# EAGLE design Cypher (EAGLE 9.0.1)
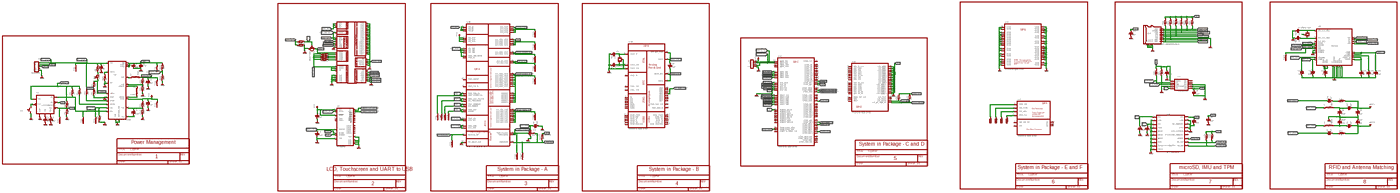
[diagram p0: schematic, sheet 1, overview]
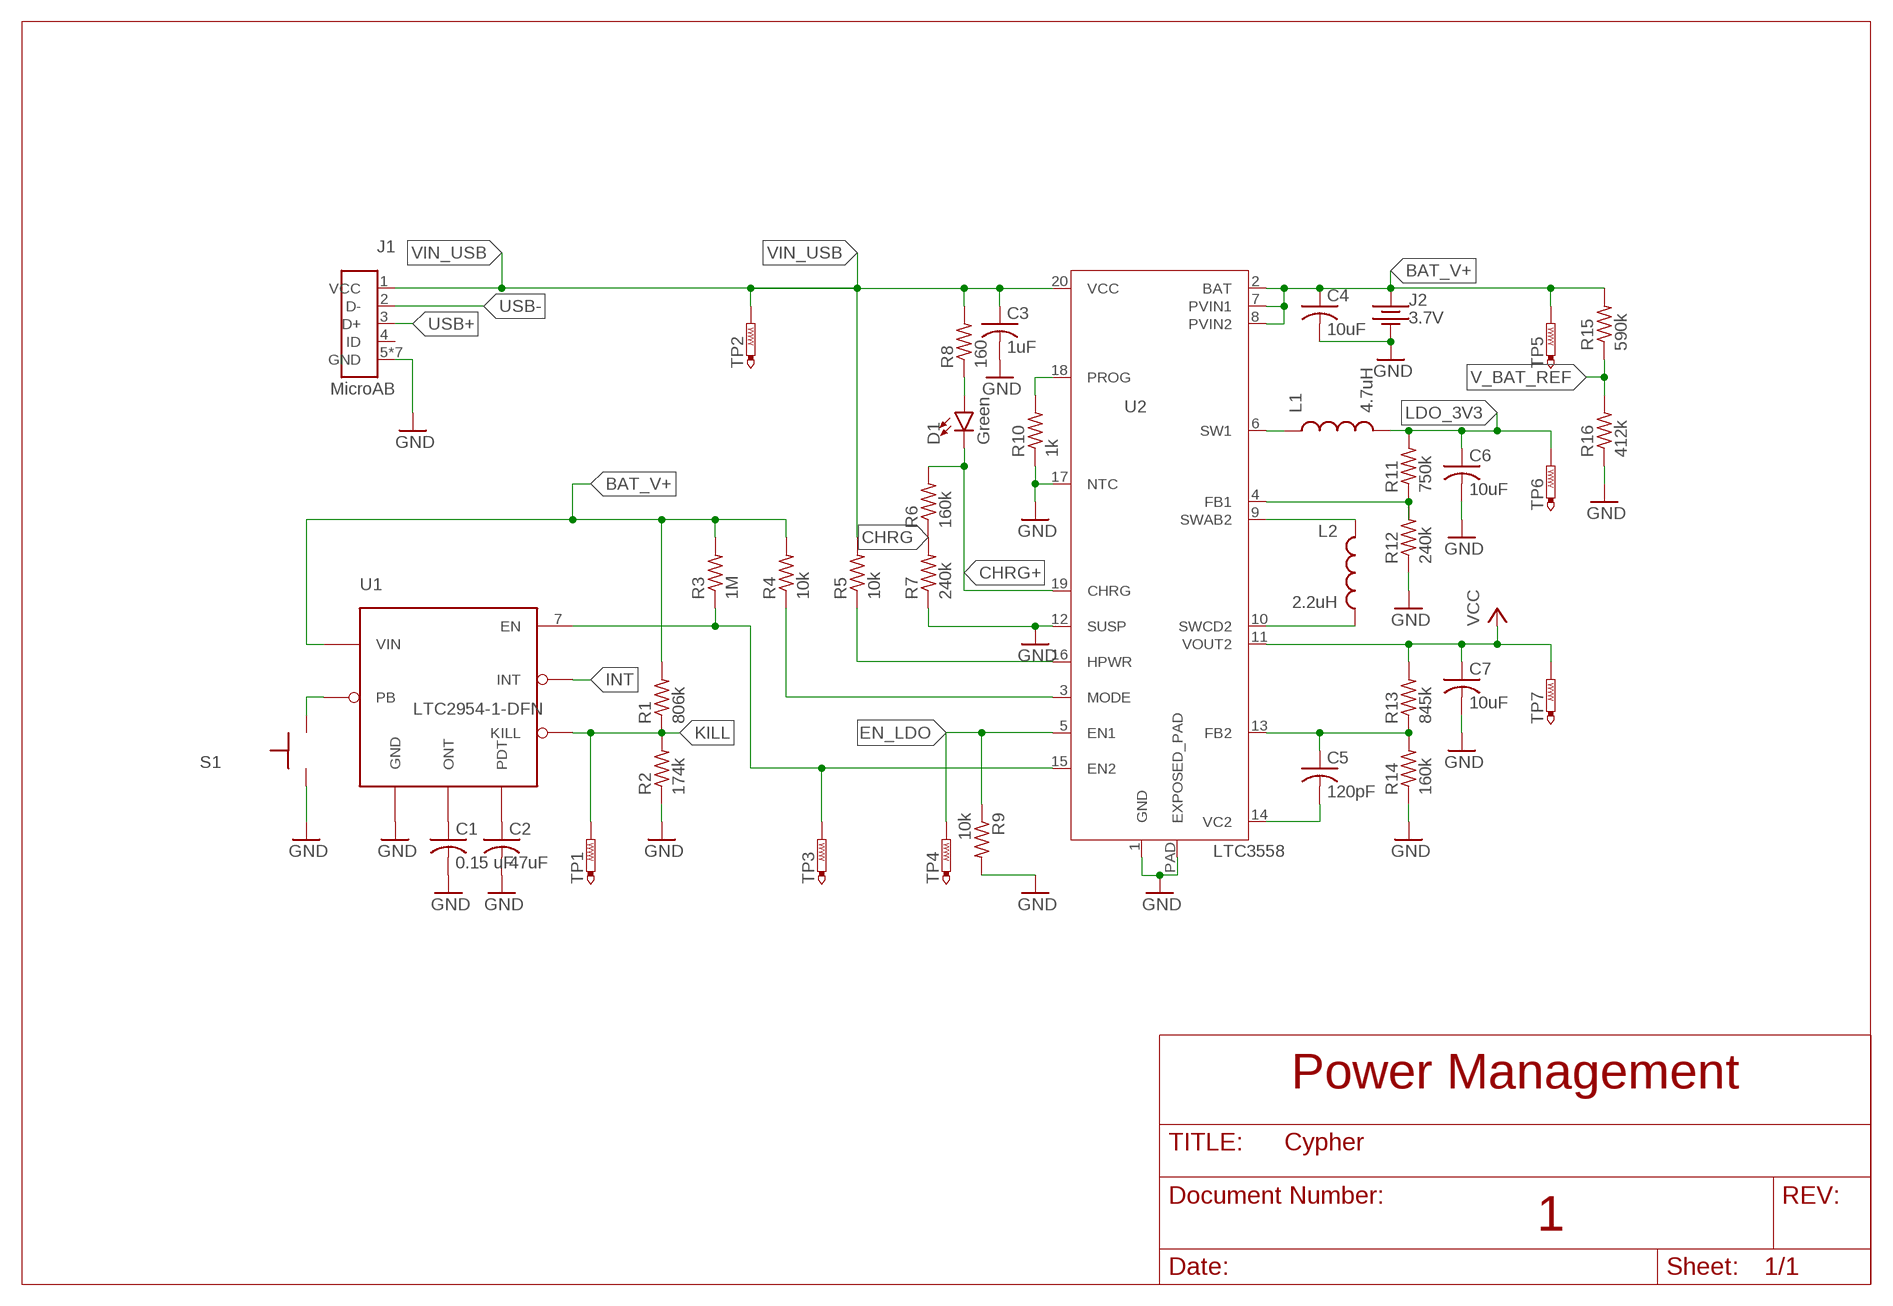
[diagram p1: schematic, sheet 1, part 1 of 6]
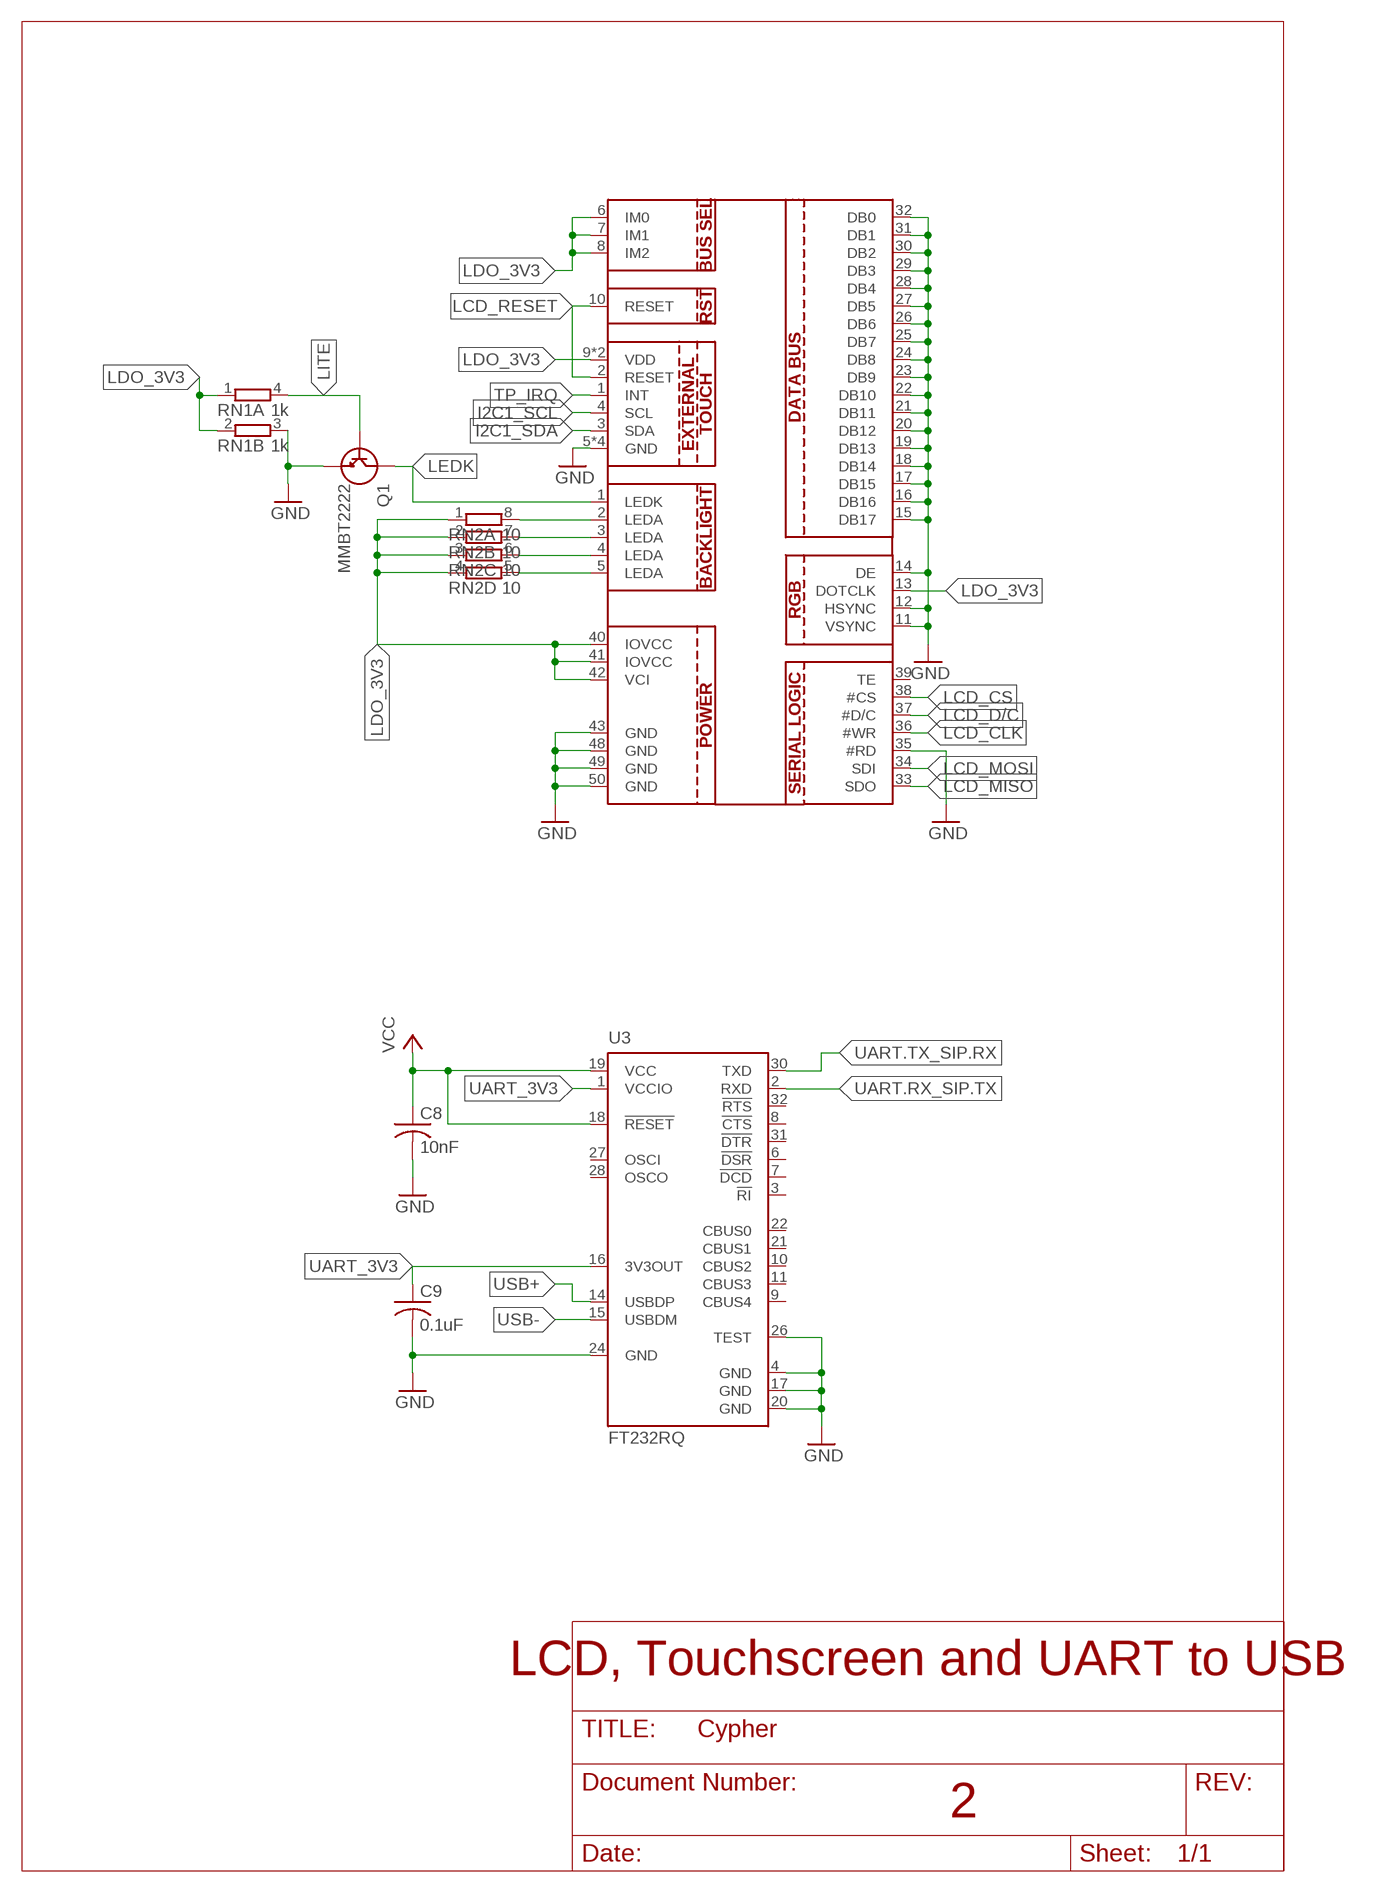
[diagram p2: schematic, sheet 1, part 2 of 6]
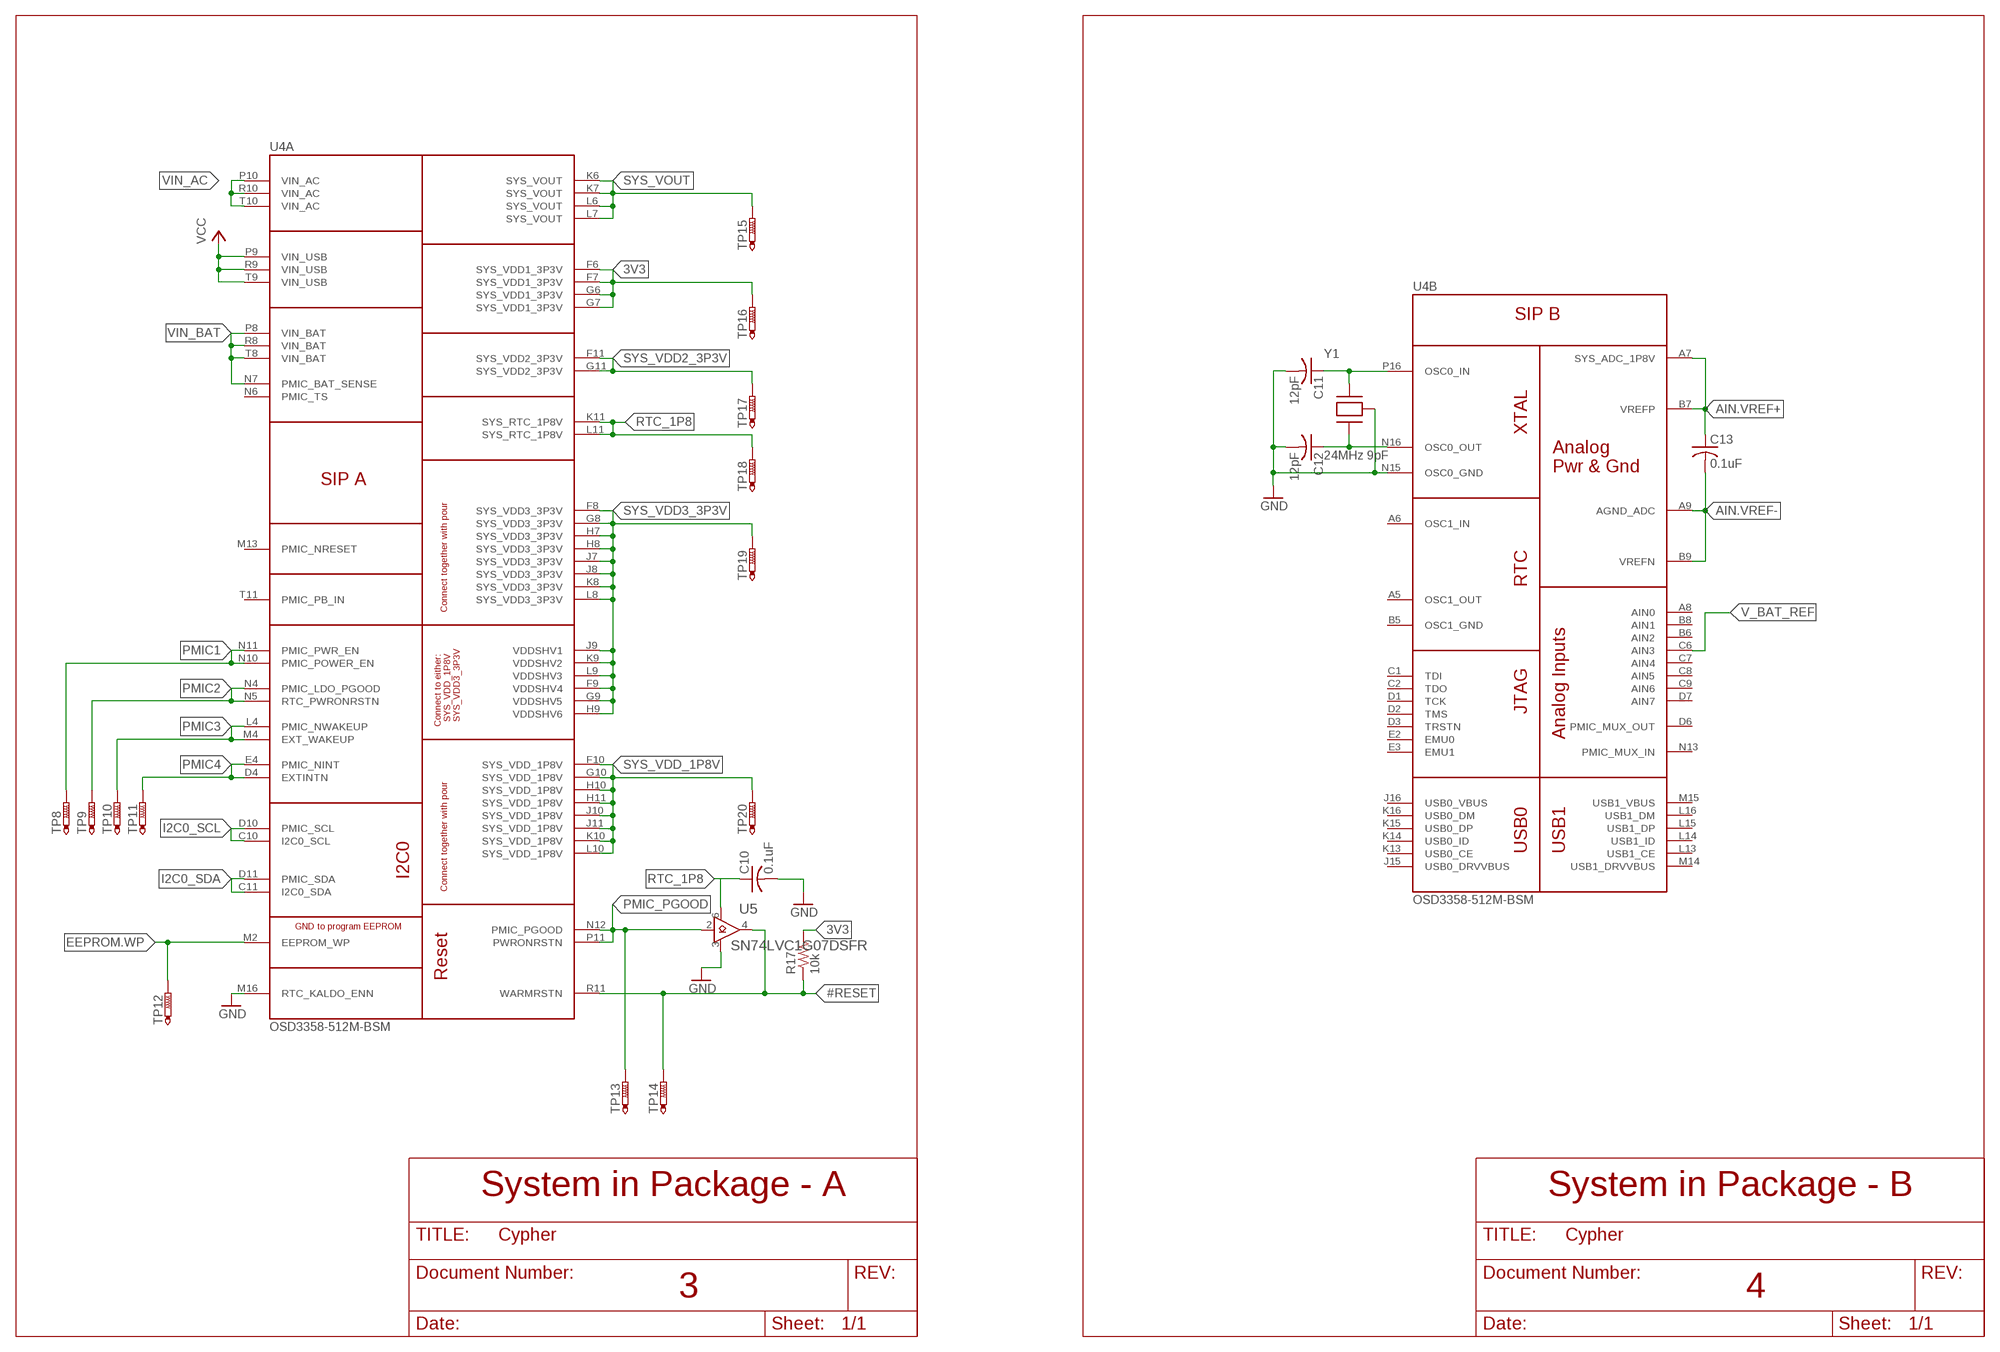
[diagram p3: schematic, sheet 1, part 3 of 6]
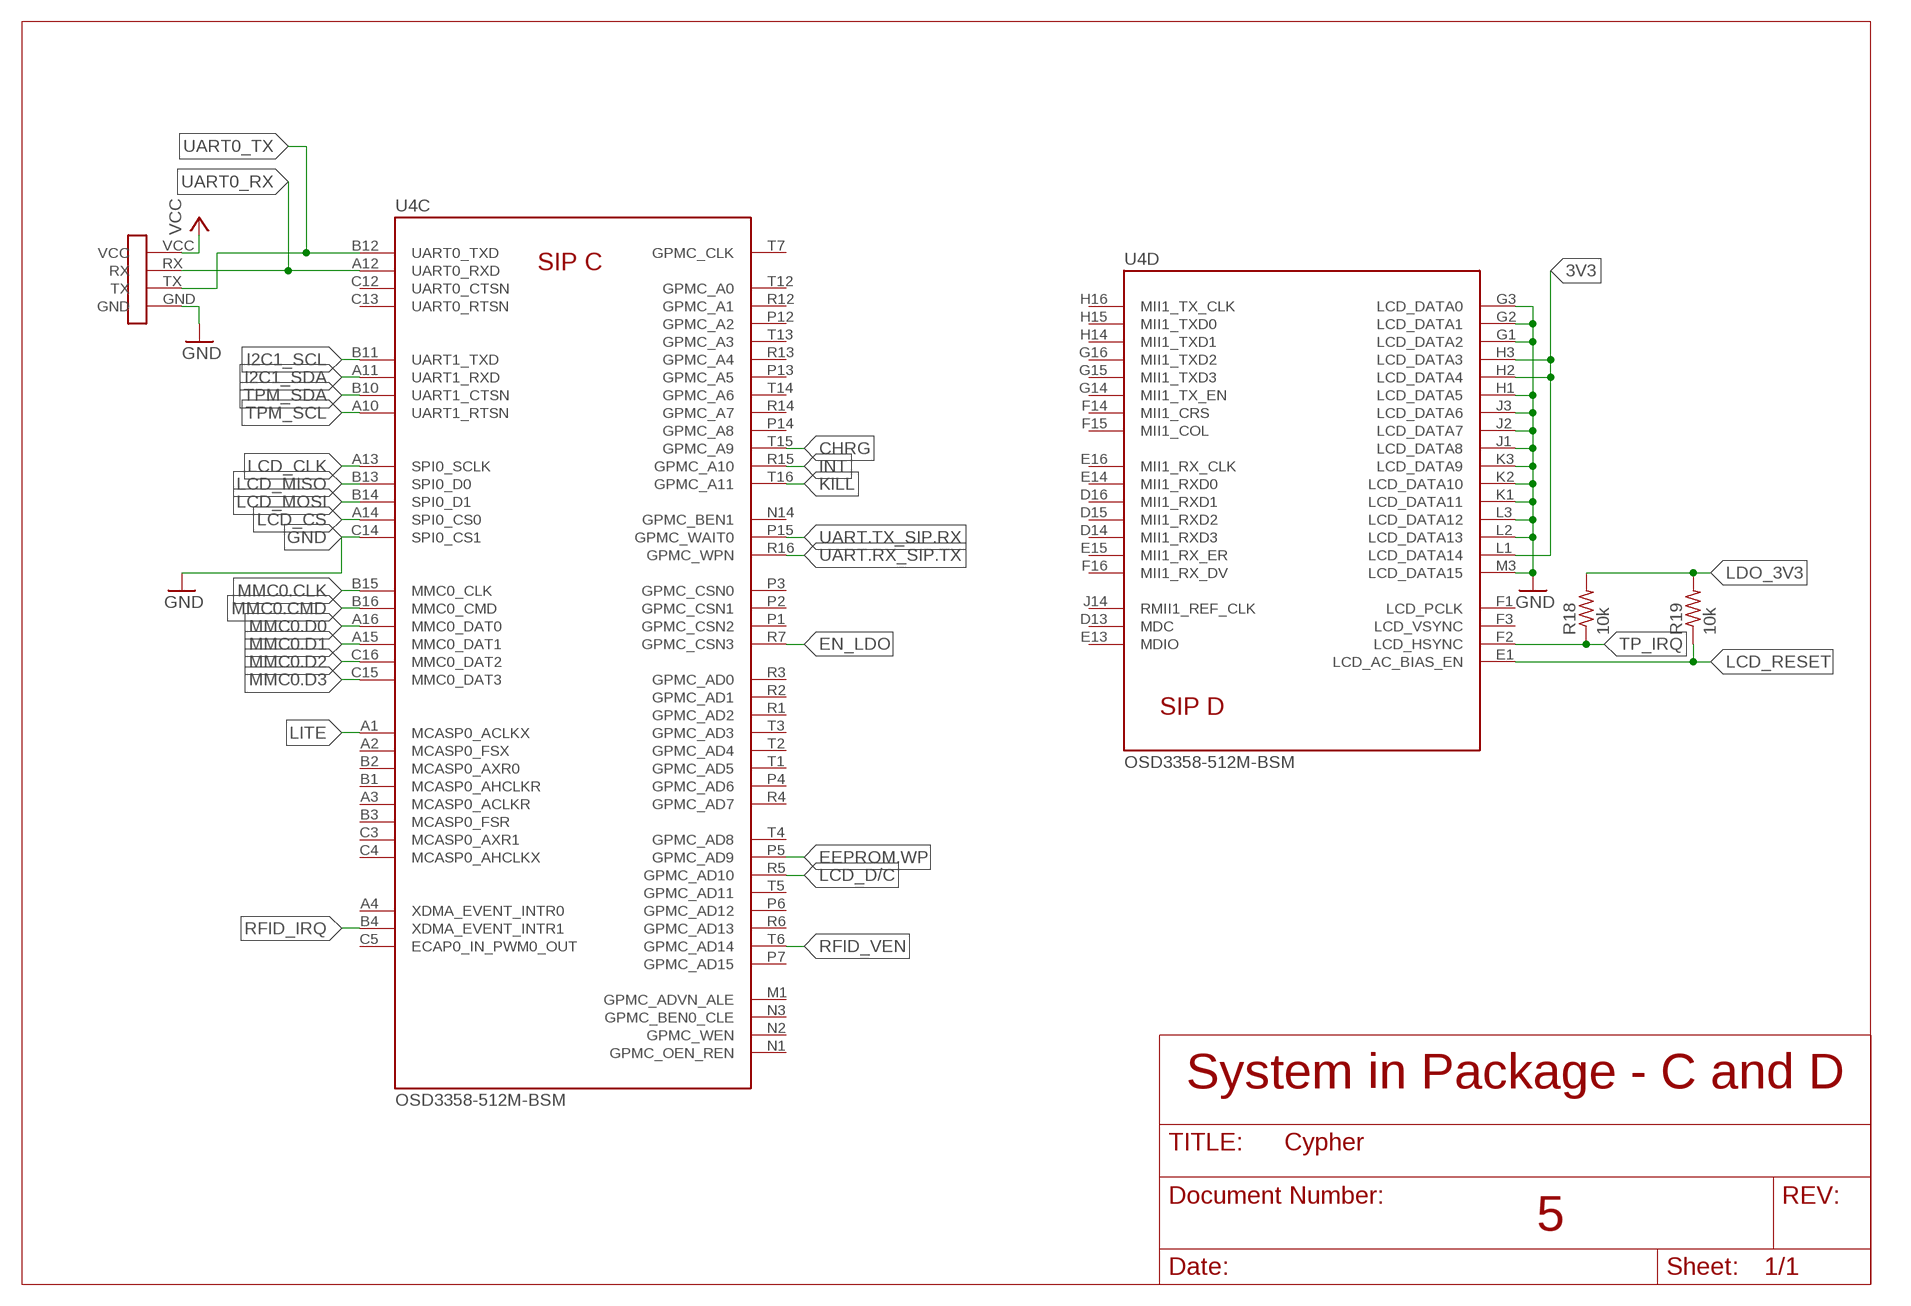
[diagram p4: schematic, sheet 1, part 4 of 6]
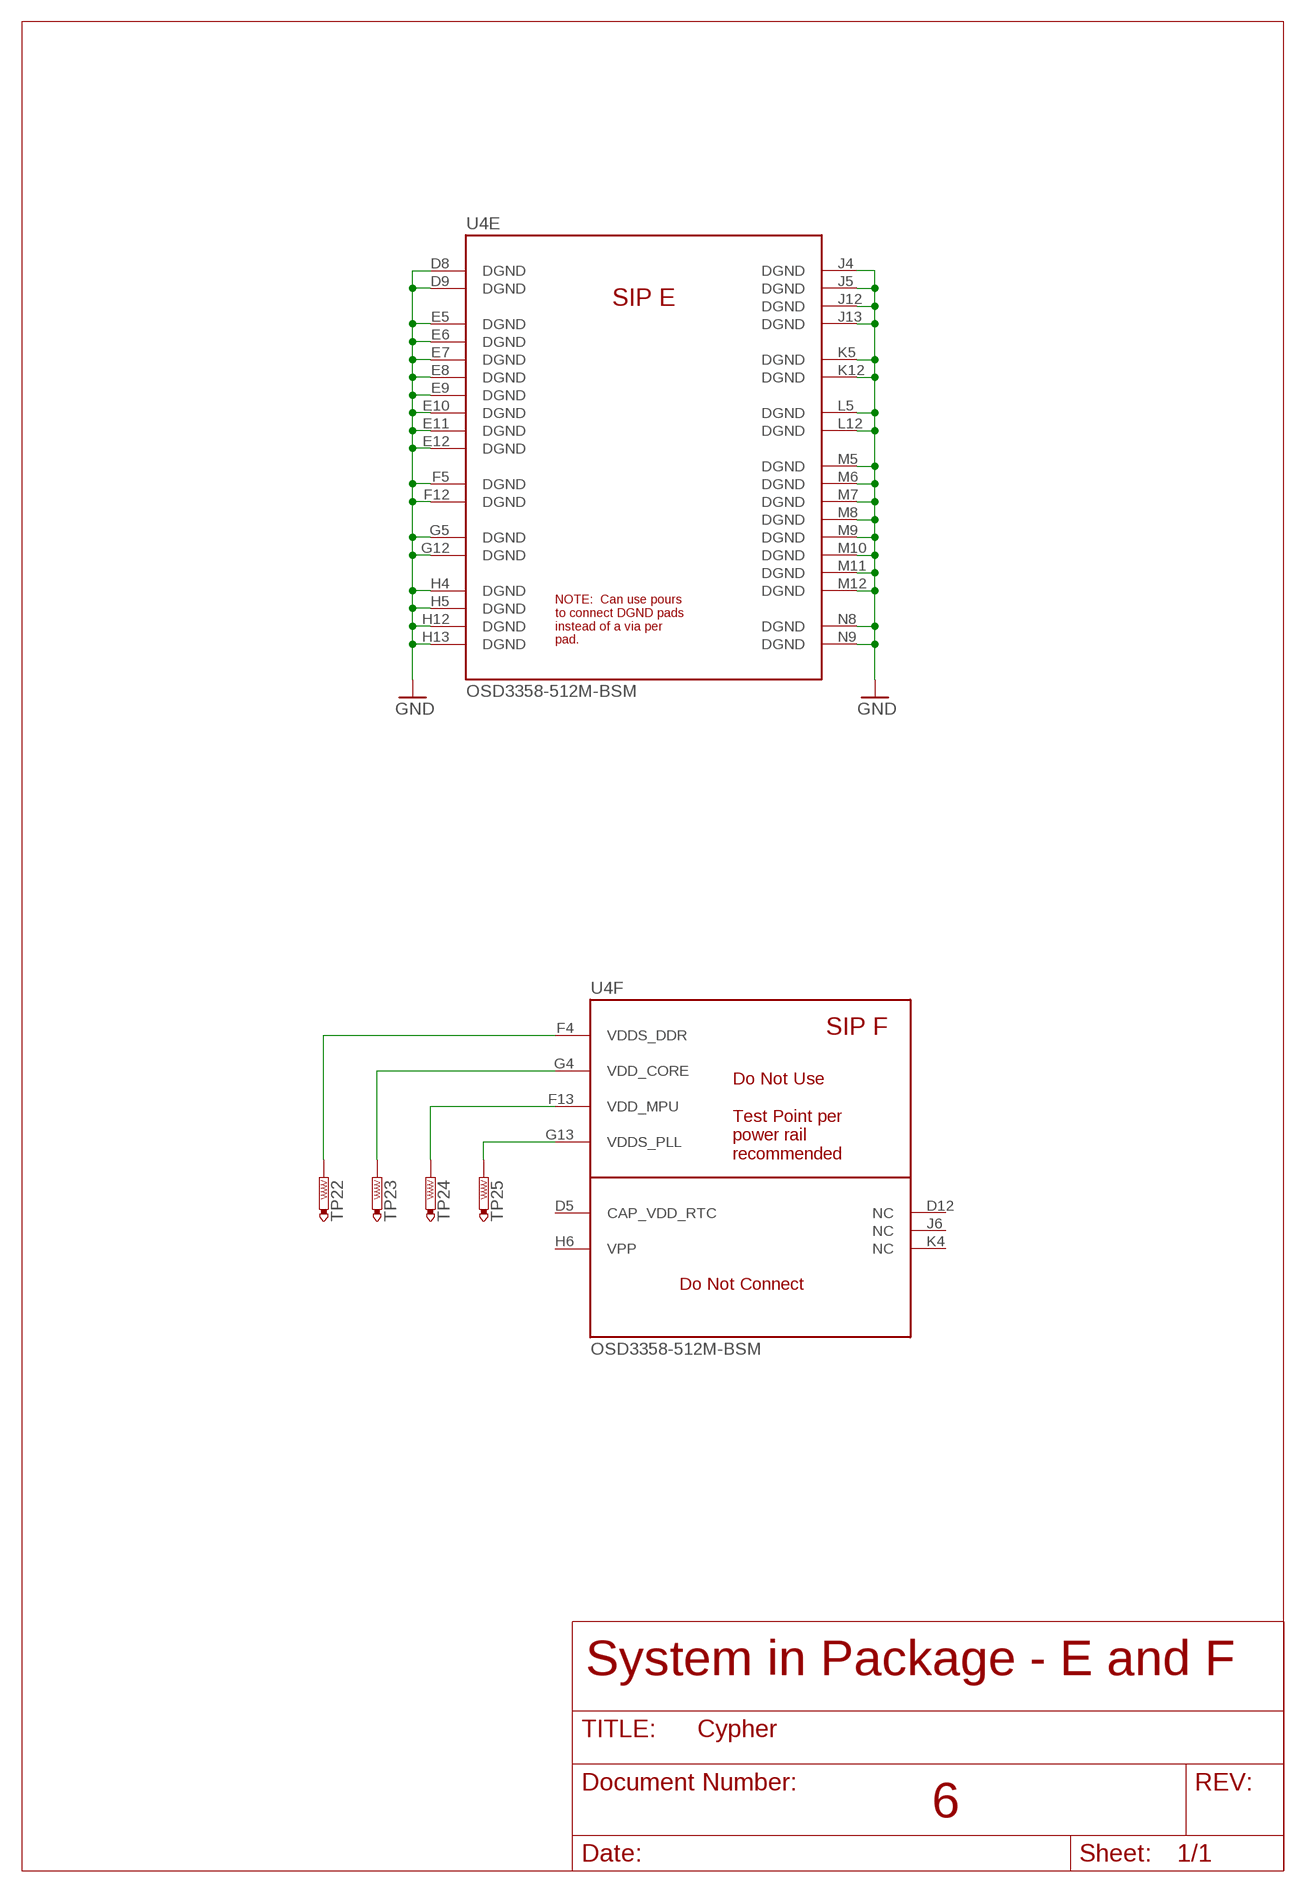
[diagram p5: schematic, sheet 1, part 5 of 6]
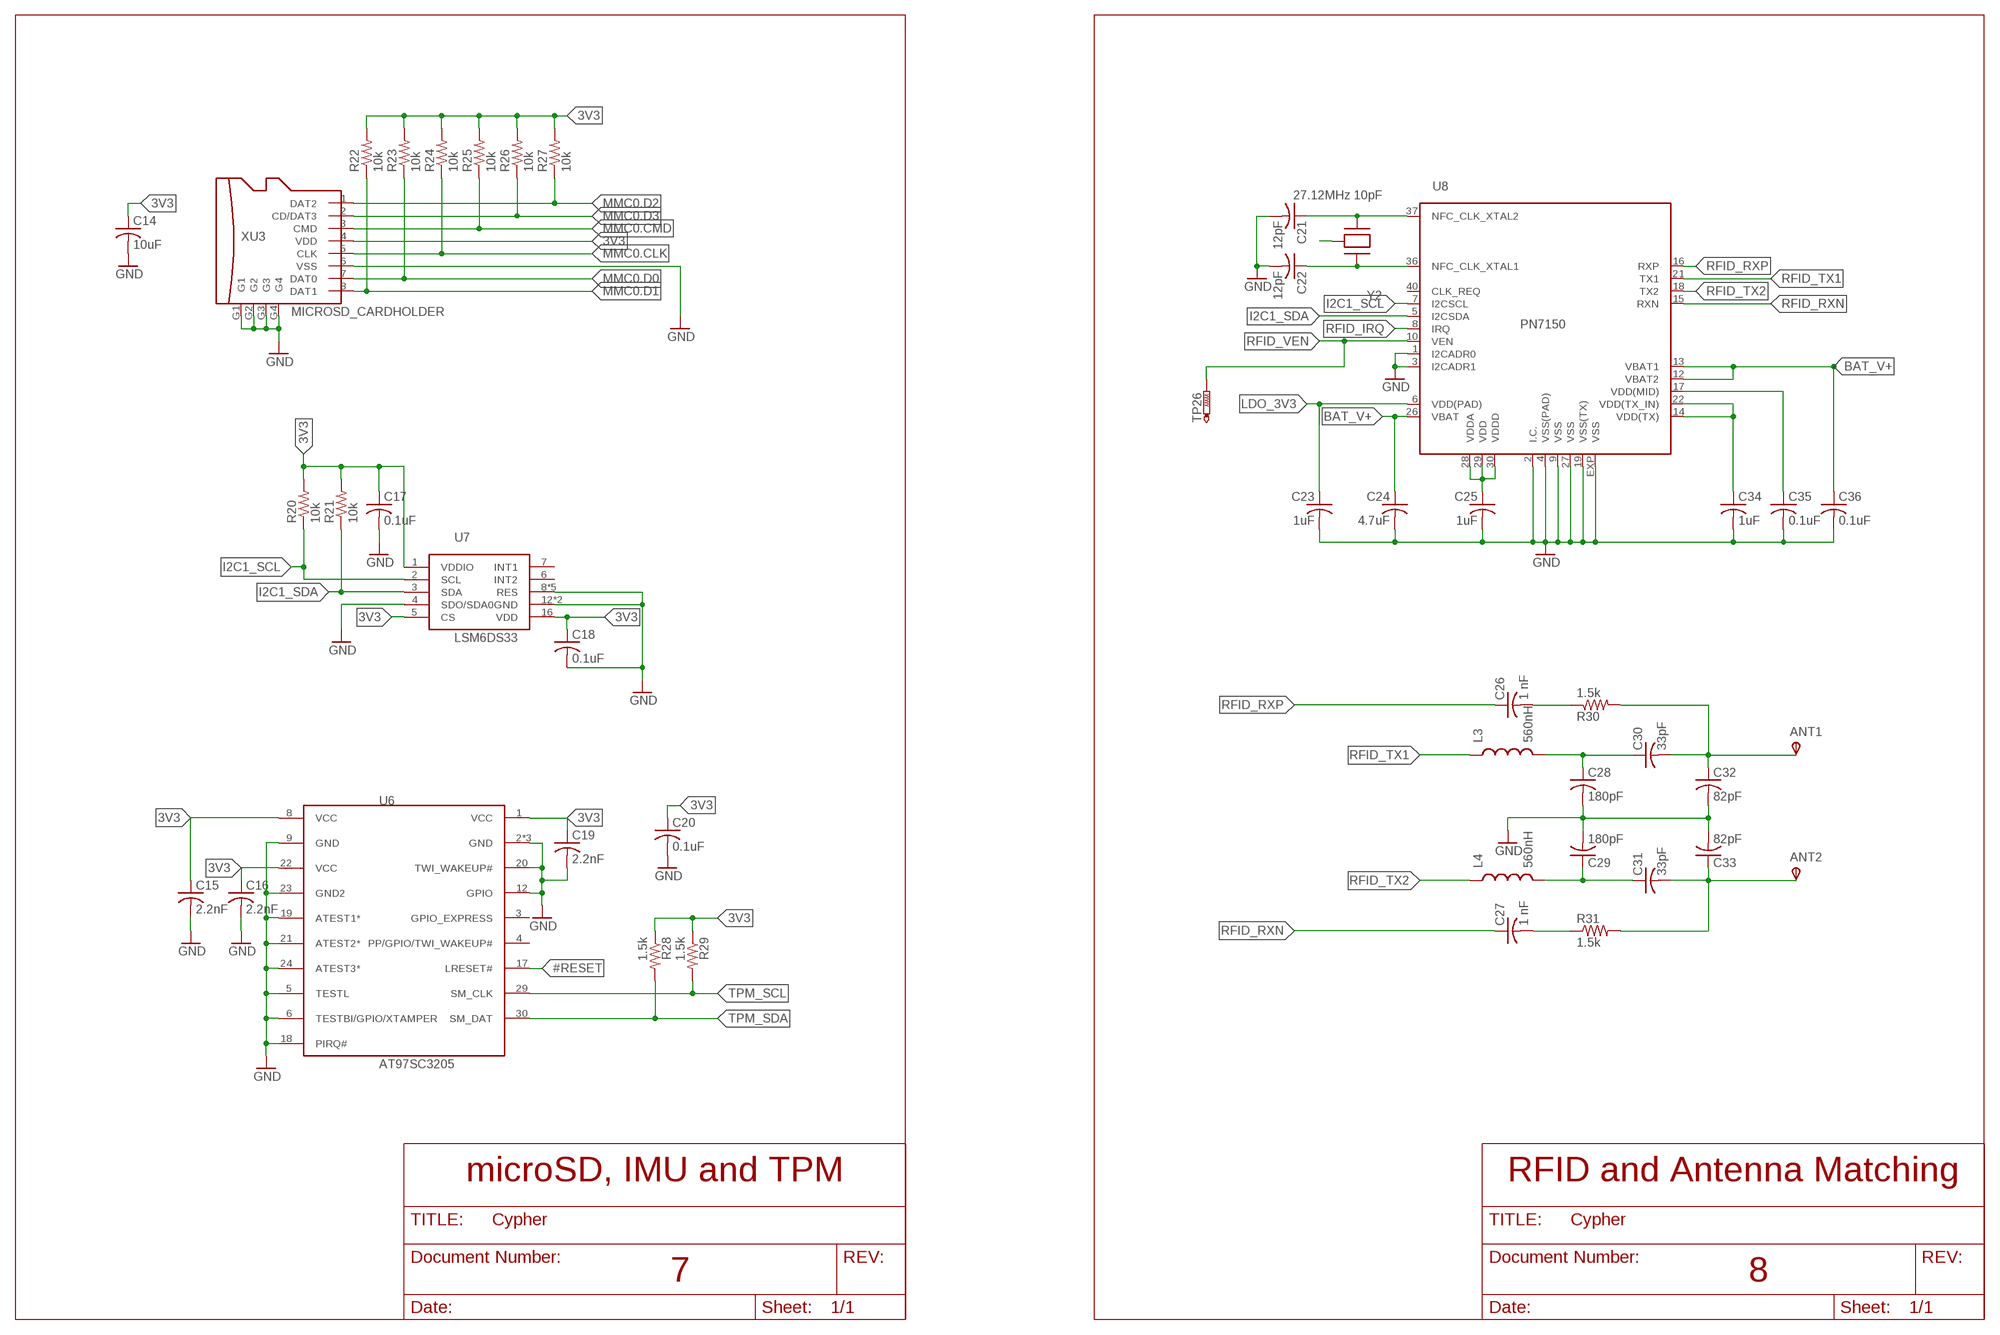
[diagram p6: schematic, sheet 1, part 6 of 6]

## Parts
ANT1  TPSB2,54  [B2,54]
ANT2  TPSB2,54  [B2,54]
C1  0.15 uF  C-USC0402  [C0402]
C2  47uF  C-USC0805  [C0805]
C3  1uF  C-USC0201  [C0201]
C4  10uF  C-USC0402  [C0402]
C5  120pF  C-USC0201  [C0201]
C6  10uF  C-USC0402  [C0402]
C7  10uF  C-USC0402  [C0402]
C8  10nF  C-USC0201  [C0201]
C9  0.1uF  C-USC0201  [C0201]
C10  0.1uF  C-USC0201  [C0201]
C11  12pF  C-USC0201  [C0201]
C12  12pF  C-USC0201  [C0201]
C13  0.1uF  C-USC0201  [C0201]
C14  10uF  C-USC0402  [C0402]
C15  2.2nF  C-USC0201  [C0201]
C16  2.2nF  C-USC0201  [C0201]
C17  0.1uF  C-USC0201  [C0201]
C18  0.1uF  C-USC0201  [C0201]
C19  2.2nF  C-USC0201  [C0201]
C20  0.1uF  C-USC0201  [C0201]
C21  12pF  C-USC0201  [C0201]
C22  12pF  C-USC0201  [C0201]
C23  1uF  C-USC0201  [C0201]
C24  4.7uF  C-USC0603  [C0603]
C25  1uF  C-USC0201  [C0201]
C26  1 nF  C-USC0603  [C0603]
C27  1 nF  C-USC0603  [C0603]
C28  180pF  C-USC0201  [C0201]
C29  180pF  C-USC0201  [C0201]
C30  33pF  C-USC0201  [C0201]
C31  33pF  C-USC0201  [C0201]
C32  82pF  C-USC0201  [C0201]
C33  82pF  C-USC0201  [C0201]
C34  1uF  C-USC0201  [C0201]
C35  0.1uF  C-USC0201  [C0201]
C36  0.1uF  C-USC0201  [C0201]
D1  Green  LED0603  [LED-0603]
J1  MicroAB  MICRO_USB_AB_SMD  [MICRO-USB-AB-SMD]
J2  3.7V  SH-CONNECTOR  [SH_CONNECTOR]
L1  4.7uH  L2520M  [L2520]
L2  2.2uH  L2520M  [L2520]
L3  560nH  INDUCTOR0402  [C0402]
L4  560nH  INDUCTOR0402  [C0402]
Q1  MMBT2222  MMBT2222_3-XFDFN  [3-XFDFN]
R1  806k  R-US_R0201  [R0201]
R2  174k  R-US_R0201  [R0201]
R3  1M  R-US_R0201  [R0201]
R4  10k  R-US_R0201  [R0201]
R5  10k  R-US_R0201  [R0201]
R6  160k  R-US_R0201  [R0201]
R7  240k  R-US_R0201  [R0201]
R8  160  R-US_R0402  [R0402]
R9  10k  R-US_R0201  [R0201]
R10  1k  R-US_R0201  [R0201]
R11  750k  R-US_R0201  [R0201]
R12  240k  R-US_R0201  [R0201]
R13  845k  R-US_R0201  [R0201]
R14  160k  R-US_R0201  [R0201]
R15  590k  R-US_R0201  [R0201]
R16  412k  R-US_R0201  [R0201]
R17  10k  R-US_R0201  [R0201]
R18  10k  R-US_R0201  [R0201]
R19  10k  R-US_R0201  [R0201]
R20  10k  R-US_R0201  [R0201]
R21  10k  R-US_R0201  [R0201]
R22  10k  R-US_R0201  [R0201]
R23  10k  R-US_R0201  [R0201]
R24  10k  R-US_R0201  [R0201]
R25  10k  R-US_R0201  [R0201]
R26  10k  R-US_R0201  [R0201]
R27  10k  R-US_R0201  [R0201]
R28  1.5k  R-US_R0201  [R0201]
R29  1.5k  R-US_R0201  [R0201]
R30  1.5k  R-US_R0402  [R0402]
R31  1.5k  R-US_R0402  [R0402]
RN1  1k  2R-NEXBV4V  [EXBV4V]
RN2  10  4R-NEXBN8V  [EXBN8V]
S1  EVQ-P7JO1P  [EVQ-P7J01P]
TP1  PTR1B1,27  [B1,27]
TP2  PTR1B1,27  [B1,27]
TP3  PTR1B1,27  [B1,27]
TP4  PTR1B1,27  [B1,27]
TP5  PTR1B1,27  [B1,27]
TP6  PTR1B1,27  [B1,27]
TP7  PTR1B1,27  [B1,27]
TP8  PTR1B1,27  [B1,27]
TP9  PTR1B1,27  [B1,27]
TP10  PTR1B1,27  [B1,27]
TP11  PTR1B1,27  [B1,27]
TP12  PTR1B1,27  [B1,27]
TP13  PTR1B1,27  [B1,27]
TP14  PTR1B1,27  [B1,27]
TP15  PTR1B1,27  [B1,27]
TP16  PTR1B1,27  [B1,27]
TP17  PTR1B1,27  [B1,27]
TP18  PTR1B1,27  [B1,27]
TP19  PTR1B1,27  [B1,27]
TP20  PTR1B1,27  [B1,27]
TP21  UARTPINS  [UARTPINS]
TP22  PTR1B1,27  [B1,27]
TP23  PTR1B1,27  [B1,27]
TP24  PTR1B1,27  [B1,27]
TP25  PTR1B1,27  [B1,27]
TP26  PTR1B1,27  [B1,27]
U1  LTC2954-1-DFN  [DFN8-3MMX2MM]
U2  LTC3558  [QFN20-3MM]
U3  FT232RQ  [QFN32]
U4  OSD3358-512M-BSM  [OSD335X-BGA-256]
U5  SN74LVC1G07DSFR  [SON35P100X100X40-6N]
U6  AT97SC3205  [QFN32-4MM]
U7  LSM6DS33  [LGA-16]
U8  PN7150  [HVQFN40]
XU1  CAPTOUCHSCREEN_6PINFPC10PIN  [DF37B-10DM-0.4V]
XU2  ILI9388_50PIN_SOCKET  [FPC/FFC_50PIN_0.5MMPITCH]
XU3  MICROSD_CARDHOLDER  [HINGED_LID_MICROSD]
Y1  24MHz 9pF  TSX-3225  [4-SMD]
Y2  27.12MHz 10pF  CRISTAL_XRCGB  [XRCGB]

## Nets
3V3: C14.1 C15.1 C16.1 C17.1 C18.1 C19.1 C20.1 R17.2 R20.2 R21.2 R22.2 R23.2 R24.2 R25.2 R26.2 R27.2 R28.1 R29.1 TP16.TP U4.F6(A:SYS_VDD1_3P3V) U4.F7(A:SYS_VDD1_3P3V) U4.G6(A:SYS_VDD1_3P3V) U4.G7(A:SYS_VDD1_3P3V) U4.H2(D:LCD_DATA4) U4.H3(D:LCD_DATA3) U4.L1(D:LCD_DATA14) U6.1(VCC) U6.8(VCC) U6.22(VCC) U7.1(VDDIO) U7.5(CS) U7.16(VDD) XU3.4(VDD)
#RESET: R17.1 TP14.TP U4.R11(A:WARMRSTN) U5.4(Y) U6.17(LRESET#)
AIN.VREF+: C13.1 U4.A7(B:SYS_ADC_1P8V) U4.B7(B:VREFP)
AIN.VREF-: C13.2 U4.A9(B:AGND_ADC) U4.B9(B:VREFN)
ANT_1: ANT1.TP(PP) C30.2 C32.1 R30.2
ANT_2: ANT2.TP(PP) C31.2 C33.1 R31.2
BAT_V+: C4.1 C24.1 C36.1 J2.1(V+) R1.2 R3.2 R4.2 R15.2 TP5.TP U1.4(VIN) U2.2(BAT) U2.7(PVIN1) U2.8(PVIN2) U8.12(VBAT2) U8.13(VBAT1) U8.26(VBAT)
CHRG: R6.1 R7.2 U4.T15(C:GPMC_A9)
CHRG+: D1.C R6.2 U2.19(CHRG)
EEPROM.WP: TP12.TP U4.M2(A:EEPROM_WP) U4.P5(C:GPMC_AD9)
EMCF_ANTM1: C28.1 C30.1 L3.2
EMCF_ANTM2: C29.1 C31.1 L4.2
EN: R3.1 TP3.TP U1.7(EN) U2.15(EN2)
EN_LDO: R9.1 TP4.TP U2.5(EN1) U4.R7(C:GPMC_CSN3)
FB1: R11.1 R12.2 U2.4(FB1)
FB2: C5.1 R13.1 R14.2 U2.13(FB2)
GND: C1.2 C2.2 C3.2 C4.2 C6.2 C7.2 C8.2 C9.2 C10.2 C11.2 C12.2 C14.2 C15.2 C16.2 C17.2 C18.2 C19.2 C20.2 C21.2 C22.2 C23.2 C24.2 C25.2 C28.2 C29.2 C32.2 C33.2 C34.2 C35.2 C36.2 J1.5(GND) J1.PAD1(GND) J1.PAD2(GND) J1.PAD3(GND) J1.PAD4(GND) J1.PAD5(GND) J1.PAD6(GND) J2.2(V-) Q1.2(E) R2.1 R7.1 R9.2 R10.1 R12.1 R14.1 R16.1 RN1.3 S1.2 S1.2' TP21.GND U1.1(GND) U1.EXP(GND) U2.1(GND) U2.12(SUSP) U2.17(NTC) U2.PAD(EXPOSED_PAD) U3.4(GND) U3.17(GND) U3.20(GND) U3.24(GND) U3.26(TEST) U4.C14(C:SPI0_CS1) U4.D8(E:DGND) U4.D9(E:DGND) U4.E5(E:DGND) U4.E6(E:DGND) U4.E7(E:DGND) U4.E8(E:DGND) U4.E9(E:DGND) U4.E10(E:DGND) U4.E11(E:DGND) U4.E12(E:DGND) U4.F5(E:DGND) U4.F12(E:DGND) U4.G1(D:LCD_DATA2) U4.G2(D:LCD_DATA1) U4.G3(D:LCD_DATA0) U4.G5(E:DGND) U4.G12(E:DGND) U4.H1(D:LCD_DATA5) U4.H4(E:DGND) U4.H5(E:DGND) U4.H12(E:DGND) U4.H13(E:DGND) U4.J1(D:LCD_DATA8) U4.J2(D:LCD_DATA7) U4.J3(D:LCD_DATA6) U4.J4(E:DGND) U4.J5(E:DGND) U4.J12(E:DGND) U4.J13(E:DGND) U4.K1(D:LCD_DATA11) U4.K2(D:LCD_DATA10) U4.K3(D:LCD_DATA9) U4.K5(E:DGND) U4.K12(E:DGND) U4.L2(D:LCD_DATA13) U4.L3(D:LCD_DATA12) U4.L5(E:DGND) U4.L12(E:DGND) U4.M3(D:LCD_DATA15) U4.M5(E:DGND) U4.M6(E:DGND) U4.M7(E:DGND) U4.M8(E:DGND) U4.M9(E:DGND) U4.M10(E:DGND) U4.M11(E:DGND) U4.M12(E:DGND) U4.M16(A:RTC_KALDO_ENN) U4.N8(E:DGND) U4.N9(E:DGND) U4.N15(B:OSC0_GND) U5.3(GND) U6.2(GND) U6.5(TESTL) U6.6(TESTBI/GPIO/XTAMPER) U6.9(GND) U6.12(GPIO) U6.18(PIRQ#) U6.19(ATEST1*) U6.20(TWI_WAKEUP#) U6.21(ATEST2*) U6.23(GND2) U6.24(ATEST3*) U6.32(GND) U6.EXP(GND) U7.4(SDO/SDA0) U7.8(RES) U7.9(RES) U7.10(RES) U7.11(RES) U7.12(GND) U7.13(GND) U7.15(RES) U8.1(I2CADR0) U8.2(I.C.) U8.3(I2CADR1) U8.4(VSS(PAD)) U8.9(VSS) U8.19(VSS(TX)) U8.27(VSS) U8.EXP(VSS) XU1.5(GND) XU1.6(GND) XU1.7(GND) XU1.8(GND) XU2.11(VSYNC) XU2.12(HSYNC) XU2.14(DE) XU2.15(DB17) XU2.16(DB16) XU2.17(DB15) XU2.18(DB14) XU2.19(DB13) XU2.20(DB12) XU2.21(DB11) XU2.22(DB10) XU2.23(DB9) XU2.24(DB8) XU2.25(DB7) XU2.26(DB6) XU2.27(DB5) XU2.28(DB4) XU2.29(DB3) XU2.30(DB2) XU2.31(DB1) XU2.32(DB0) XU2.35(#RD) XU2.43(GND) XU2.48(GND) XU2.49(GND) XU2.50(GND) XU3.6(VSS) XU3.G1 XU3.G2 XU3.G3 XU3.G4 Y1.2(GND) Y1.4(GND)
HPWR: R5.1 U2.16(HPWR)
I2C0_SCL: U4.C10(A:I2C0_SCL) U4.D10(A:PMIC_SCL)
I2C0_SDA: U4.C11(A:I2C0_SDA) U4.D11(A:PMIC_SDA)
I2C1_SCL: R20.1 U4.B11(C:UART1_TXD) U7.2(SCL) U8.7(I2CSCL) XU1.4(SCL)
I2C1_SDA: R21.1 U4.A11(C:UART1_RXD) U7.3(SDA) U8.5(I2CSDA) XU1.3(SDA)
INT: U1.8(INT) U4.R15(C:GPMC_A10)
KILL: R1.1 R2.2 TP1.TP U1.5(KILL) U4.T16(C:GPMC_A11)
LCD_CLK: U4.A13(C:SPI0_SCLK) XU2.36(#WR)
LCD_CS: U4.A14(C:SPI0_CS0) XU2.38(#CS)
LCD_D/C: U4.R5(C:GPMC_AD10) XU2.37(#D/C)
LCD_MISO: U4.B13(C:SPI0_D0) XU2.33(SDO)
LCD_MOSI: U4.B14(C:SPI0_D1) XU2.34(SDI)
LCD_RESET: R19.1 U4.E1(D:LCD_AC_BIAS_EN) XU1.2(RESET) XU2.10(RESET)
LDO_3V3: C6.1 C23.1 L1.2 R11.2 R18.2 R19.2 RN1.1 RN1.2 RN2.1 RN2.2 RN2.3 RN2.4 TP6.TP U8.6(VDD(PAD)) XU1.9(VDD) XU1.10(VDD) XU2.6(IM0) XU2.7(IM1) XU2.8(IM2) XU2.13(DOTCLK) XU2.40(IOVCC) XU2.41(IOVCC) XU2.42(VCI)
LDO_BOOSTER_MODE: R4.1 U2.3(MODE)
LED_A: D1.A R8.1
LEDA@2: RN2.8 XU2.2(LEDA)
LEDA@3: RN2.7 XU2.3(LEDA)
LEDA@4: RN2.6 XU2.4(LEDA)
LEDA@5: RN2.5 XU2.5(LEDA)
LEDK: Q1.3(C) XU2.1(LEDK)
LITE: Q1.1(B) RN1.4 U4.A1(C:MCASP0_ACLKX)
MMC0.CLK: R24.1 U4.B15(C:MMC0_CLK) XU3.5(CLK)
MMC0.CMD: R25.1 U4.B16(C:MMC0_CMD) XU3.3(CMD)
MMC0.D0: R23.1 U4.A16(C:MMC0_DAT0) XU3.7(DAT0)
MMC0.D1: R22.1 U4.A15(C:MMC0_DAT1) XU3.8(DAT1)
MMC0.D2: R27.1 U4.C16(C:MMC0_DAT2) XU3.1(DAT2)
MMC0.D3: R26.1 U4.C15(C:MMC0_DAT3) XU3.2(CD/DAT3)
NC: Y2.2(GND) Y2.4(GND)
ON_T: C1.1 U1.2(ONT)
PB: S1.1 S1.1' U1.3(PB)
PD_T: C2.1 U1.6(PDT)
PMIC1: TP8.TP U4.N10(A:PMIC_POWER_EN) U4.N11(A:PMIC_PWR_EN)
PMIC2: TP9.TP U4.N4(A:PMIC_LDO_PGOOD) U4.N5(A:RTC_PWRONRSTN)
PMIC3: TP10.TP U4.L4(A:PMIC_NWAKEUP) U4.M4(A:EXT_WAKEUP)
PMIC4: TP11.TP U4.D4(A:EXTINTN) U4.E4(A:PMIC_NINT)
PMIC_PGOOD: TP13.TP U4.N12(A:PMIC_PGOOD) U4.P11(A:PWRONRSTN) U5.2(A)
PROG: R10.2 U2.18(PROG)
RFID_IRQ: U4.B4(C:XDMA_EVENT_INTR1) U8.8(IRQ)
RFID_MISC_1: C26.2 R30.1
RFID_MISC_2: C27.2 R31.1
RFID_OSC_IN: C22.1 U8.36(NFC_CLK_XTAL1) Y2.1(OSC_IN)
RFID_OSC_OUT: C21.1 U8.37(NFC_CLK_XTAL2) Y2.3(OSC_OUT)
RFID_RXN: C27.1 U8.15(RXN)
RFID_RXP: C26.1 U8.16(RXP)
RFID_TX1: L3.1 U8.21(TX1)
RFID_TX2: L4.1 U8.18(TX2)
RFID_VEN: TP26.TP U4.T6(C:GPMC_AD14) U8.10(VEN)
RTC_1P8: C10.1 TP18.TP U4.K11(A:SYS_RTC_1P8V) U4.L11(A:SYS_RTC_1P8V) U5.6(VCC)
SIP_OSC_IN: C11.1 U4.P16(B:OSC0_IN) Y1.1(OSC_IN)
SIP_OSC_OUT: C12.1 U4.N16(B:OSC0_OUT) Y1.3(OSC_OUT)
SW1: L1.1 U2.6(SW1)
SWAB2: L2.1 U2.9(SWAB2)
SWCD2: L2.2 U2.10(SWCD2)
SYS_VDD2_3P3V: TP17.TP U4.F11(A:SYS_VDD2_3P3V) U4.G11(A:SYS_VDD2_3P3V)
SYS_VDD3_3P3V: TP19.TP U4.F8(A:SYS_VDD3_3P3V) U4.F9(A:VDDSHV4) U4.G8(A:SYS_VDD3_3P3V) U4.G9(A:VDDSHV5) U4.H7(A:SYS_VDD3_3P3V) U4.H8(A:SYS_VDD3_3P3V) U4.H9(A:VDDSHV6) U4.J7(A:SYS_VDD3_3P3V) U4.J8(A:SYS_VDD3_3P3V) U4.J9(A:VDDSHV1) U4.K8(A:SYS_VDD3_3P3V) U4.K9(A:VDDSHV2) U4.L8(A:SYS_VDD3_3P3V) U4.L9(A:VDDSHV3)
SYS_VDD_1P8V: TP20.TP U4.F10(A:SYS_VDD_1P8V) U4.G10(A:SYS_VDD_1P8V) U4.H10(A:SYS_VDD_1P8V) U4.H11(A:SYS_VDD_1P8V) U4.J10(A:SYS_VDD_1P8V) U4.J11(A:SYS_VDD_1P8V) U4.K10(A:SYS_VDD_1P8V) U4.L10(A:SYS_VDD_1P8V)
SYS_VOUT: TP15.TP U4.K6(A:SYS_VOUT) U4.K7(A:SYS_VOUT) U4.L6(A:SYS_VOUT) U4.L7(A:SYS_VOUT)
TP_IRQ: R18.1 U4.F2(D:LCD_HSYNC) XU1.1(INT)
TPM_SCL: R29.2 U4.A10(C:UART1_RTSN) U6.29(SM_CLK)
TPM_SDA: R28.2 U4.B10(C:UART1_CTSN) U6.30(SM_DAT)
UART0_RX: TP21.RX U4.A12(C:UART0_RXD)
UART0_TX: TP21.TX U4.B12(C:UART0_TXD)
UART.RX_SIP.TX: U3.2(RXD) U4.R16(C:GPMC_WPN)
UART.TX_SIP.RX: U3.30(TXD) U4.P15(C:GPMC_WAIT0)
UART_3V3: C9.1 U3.1(VCCIO) U3.16(3V3OUT)
USB+: J1.3(D+) U3.14(USBDP)
USB-: J1.2(D-) U3.15(USBDM)
V_BAT_REF: R15.1 R16.2 U4.C6(B:AIN3)
VC2: C5.2 U2.14(VC2)
VCC: C7.1 C8.1 R13.2 TP7.TP TP21.VCC U2.11(VOUT2) U3.18(!RESET) U3.19(VCC) U4.P9(A:VIN_USB) U4.R9(A:VIN_USB) U4.T9(A:VIN_USB)
VDD: C25.1 U8.28(VDDA) U8.29(VDD) U8.30(VDDD)
VDD(MID): C35.1 U8.17(VDD(MID))
VDD(TX): C34.1 U8.14(VDD(TX)) U8.22(VDD(TX_IN))
VDD_CORE: TP23.TP U4.G4(F:VDD_CORE)
VDD_MPU: TP24.TP U4.F13(F:VDD_MPU)
VDDS_DDR: TP22.TP U4.F4(F:VDDS_DDR)
VDDS_PLL: TP25.TP U4.G13(F:VDDS_PLL)
VIN_AC: U4.P10(A:VIN_AC) U4.R10(A:VIN_AC) U4.T10(A:VIN_AC)
VIN_BAT: U4.N7(A:PMIC_BAT_SENSE) U4.P8(A:VIN_BAT) U4.R8(A:VIN_BAT) U4.T8(A:VIN_BAT)
VIN_USB: C3.1 J1.1(VCC) R5.2 R8.2 TP2.TP U2.20(VCC)
Unconnected: J1.4(ID) U3.3(!RI) U3.6(!DSR) U3.7(!DCD) U3.8(!CTS) U3.9(CBUS4) U3.10(CBUS2) U3.11(CBUS3) U3.21(CBUS1) U3.22(CBUS0) U3.27(OSCI) U3.28(OSCO) U3.31(!DTR) U3.32(!RTS) U4.A2(C:MCASP0_FSX) U4.A3(C:MCASP0_ACLKR) U4.A4(C:XDMA_EVENT_INTR0) U4.A5(B:OSC1_OUT) U4.A6(B:OSC1_IN) U4.A8(B:AIN0) U4.B1(C:MCASP0_AHCLKR) U4.B2(C:MCASP0_AXR0) U4.B3(C:MCASP0_FSR) U4.B5(B:OSC1_GND) U4.B6(B:AIN2) U4.B8(B:AIN1) U4.C1(B:TDI) U4.C2(B:TDO) U4.C3(C:MCASP0_AXR1) U4.C4(C:MCASP0_AHCLKX) U4.C5(C:ECAP0_IN_PWM0_OUT) U4.C7(B:AIN4) U4.C8(B:AIN5) U4.C9(B:AIN6) U4.C12(C:UART0_CTSN) U4.C13(C:UART0_RTSN) U4.D1(B:TCK) U4.D2(B:TMS) U4.D3(B:TRSTN) U4.D5(F:CAP_VDD_RTC) U4.D6(B:PMIC_MUX_OUT) U4.D7(B:AIN7) U4.D12(F:NC) U4.D13(D:MDC) U4.D14(D:MII1_RXD3) U4.D15(D:MII1_RXD2) U4.D16(D:MII1_RXD1) U4.E2(B:EMU0) U4.E3(B:EMU1) U4.E13(D:MDIO) U4.E14(D:MII1_RXD0) U4.E15(D:MII1_RX_ER) U4.E16(D:MII1_RX_CLK) U4.F1(D:LCD_PCLK) U4.F3(D:LCD_VSYNC) U4.F14(D:MII1_CRS) U4.F15(D:MII1_COL) U4.F16(D:MII1_RX_DV) U4.G14(D:MII1_TX_EN) U4.G15(D:MII1_TXD3) U4.G16(D:MII1_TXD2) U4.H6(F:VPP) U4.H14(D:MII1_TXD1) U4.H15(D:MII1_TXD0) U4.H16(D:MII1_TX_CLK) U4.J6(F:NC) U4.J14(D:RMII1_REF_CLK) U4.J15(B:USB0_DRVVBUS) U4.J16(B:USB0_VBUS) U4.K4(F:NC) U4.K13(B:USB0_CE) U4.K14(B:USB0_ID) U4.K15(B:USB0_DP) U4.K16(B:USB0_DM) U4.L13(B:USB1_CE) U4.L14(B:USB1_ID) U4.L15(B:USB1_DP) U4.L16(B:USB1_DM) U4.M1(C:GPMC_ADVN_ALE) U4.M13(A:PMIC_NRESET) U4.M14(B:USB1_DRVVBUS) U4.M15(B:USB1_VBUS) U4.N1(C:GPMC_OEN_REN) U4.N2(C:GPMC_WEN) U4.N3(C:GPMC_BEN0_CLE) U4.N6(A:PMIC_TS) U4.N13(B:PMIC_MUX_IN) U4.N14(C:GPMC_BEN1) U4.P1(C:GPMC_CSN2) U4.P2(C:GPMC_CSN1) U4.P3(C:GPMC_CSN0) U4.P4(C:GPMC_AD6) U4.P6(C:GPMC_AD12) U4.P7(C:GPMC_AD15) U4.P12(C:GPMC_A2) U4.P13(C:GPMC_A5) U4.P14(C:GPMC_A8) U4.R1(C:GPMC_AD2) U4.R2(C:GPMC_AD1) U4.R3(C:GPMC_AD0) U4.R4(C:GPMC_AD7) U4.R6(C:GPMC_AD13) U4.R12(C:GPMC_A1) U4.R13(C:GPMC_A4) U4.R14(C:GPMC_A7) U4.T1(C:GPMC_AD5) U4.T2(C:GPMC_AD4) U4.T3(C:GPMC_AD3) U4.T4(C:GPMC_AD8) U4.T5(C:GPMC_AD11) U4.T7(C:GPMC_CLK) U4.T11(A:PMIC_PB_IN) U4.T12(C:GPMC_A0) U4.T13(C:GPMC_A3) U4.T14(C:GPMC_A6) U5.1(N.C_2) U5.5(N.C) U6.3(GPIO_EXPRESS) U6.4(PP/GPIO/TWI_WAKEUP#) U7.6(INT2) U7.7(INT1) U8.40(CLK_REQ) XU2.39(TE)

## Notes on the sheet
- Power Management
- System in Package - C and D
- 1
- 5
- System in Package - E and F | microSD, IMU and TPM | RFID and Antenna Matching
- LCD, Touchscreen and UART to USB | System in Package - A | System in Package - B
- 6 | 7 | 8
- 2 | 3 | 4

## Library data of the parts
ANT1 ANT2 = testpad:TPS: TEST PIN
C1-C36 = resistor:C-US: CAPACITOR, American symbol
D1 = SparkFun-LED:LED: LED (Generic) Standard schematic elements and footprints for 5mm, 3mm, 1206, and 0603 sized LEDs. Generic LEDs with no color specified.
J1 = Megahash:MICRO_USB_AB_SMD
J2 = Megahash:SH-CONNECTOR
L1 L2 = Megahash:L2520M
L3 L4 = TPM:INDUCTOR: Inductors Basic Inductor/Choke - 0603 and 1206. Footprints are not proven and vary greatly between part numbers. INDUCTOR POWER 3.3UH 4.0A SMD 0.197" L x 0.197" W x 0.177" H (5.00mm x 5.00mm x 4.50mm)
Q1 = Megahash:MMBT2222_3-XFDFN
R1-R31 = resistor:R-US_: RESISTOR, American symbol
RN1 = resistor-dil:2R-N: Array Chip Resistor Source: Panasonic; OC_FARNELL: unknown; OC_NEWARK: unknown
RN2 = resistor-dil:4R-N: Array Chip Resistor Source: RS Component / Phycomp; OC_FARNELL: unknown; OC_NEWARK: unknown
S1 = Megahash:EVQ-P7JO1P
TP1-TP20 TP22-TP26 = testpad:PTR1: TEST PIN
TP21 = Megahash:UARTPINS
U1 = Megahash:LTC2954-1-DFN
U2 = Megahash:LTC3558
U3 = ftdichip:FT232R: Source: http://www.ftdichip.com/Documents/DataSheets/DS_FT232R_v104.pdf; MPN: FT232RQ-REEL; OC_FARNELL: 1146033; OC_NEWARK: 91K9919
U4 = Octavo-Systems:OSD3358-512M-BSM: Octavo Systems LLC OSD335x Family SiP: 21mm x 21mm, 1.27mm pitch 256 pin BGA contains AM3358, 512MB DDR3, TPS65217, TL5209, EEPROM and passives. Commerical Temperature: 0C to 85C.; MPN: BB-POCKET; OC_NEWARK: 45AC6372
U5 = Texas Instruments_By_element14_Batch_1:SN74LVC1G07DSFR: SINGLE BUFFER/DRIVER; MPN: SN74LVC1G07DSFR; OC_FARNELL: 2057110; OC_NEWARK: 64T4114; PACKAGE: SON-6; SUPPLIER: TEXAS INSTRUMENTS
U6 = Megahash:AT97SC3205: AT97SC3205 Atmel Trusted Platform Module – I2C Interface The Atmel AT97SC3205 is a fully integrated security module designed to be integrated into personal computers and other embedded systems. It implements version 1.2 of the Trusted Computing Group (TCG) specification for Trusted Platform Modules (TPM). Package: 32 pin QFN Online info: Datasheet <http://ww1.microchip.com/downloads/en/DeviceDoc/Atmel-8883S-TPM-AT97SC3205T-Datasheet-Summary.pdf> and Digikey page <https://www.digikey.com/product-detail/en/microchip-technology/AT97SC3205T-G3M4C-10/AT97SC3205T-G3M4C-10CT-ND/7796837>.
U7 = Megahash:LSM6DS33; MPN: LSM6DS33TR; OC_NEWARK: 18AC7419
U8 = Megahash:PN7150
XU1 = Megahash:CAPTOUCHSCREEN_6PINFPC
XU2 = Megahash:ILI9388_50PIN_SOCKET
XU3 = Megahash:MICROSD_CARDHOLDER
Y1 = Megahash:TSX-3225
Y2 = Megahash:CRISTAL_XRCGB

## Board
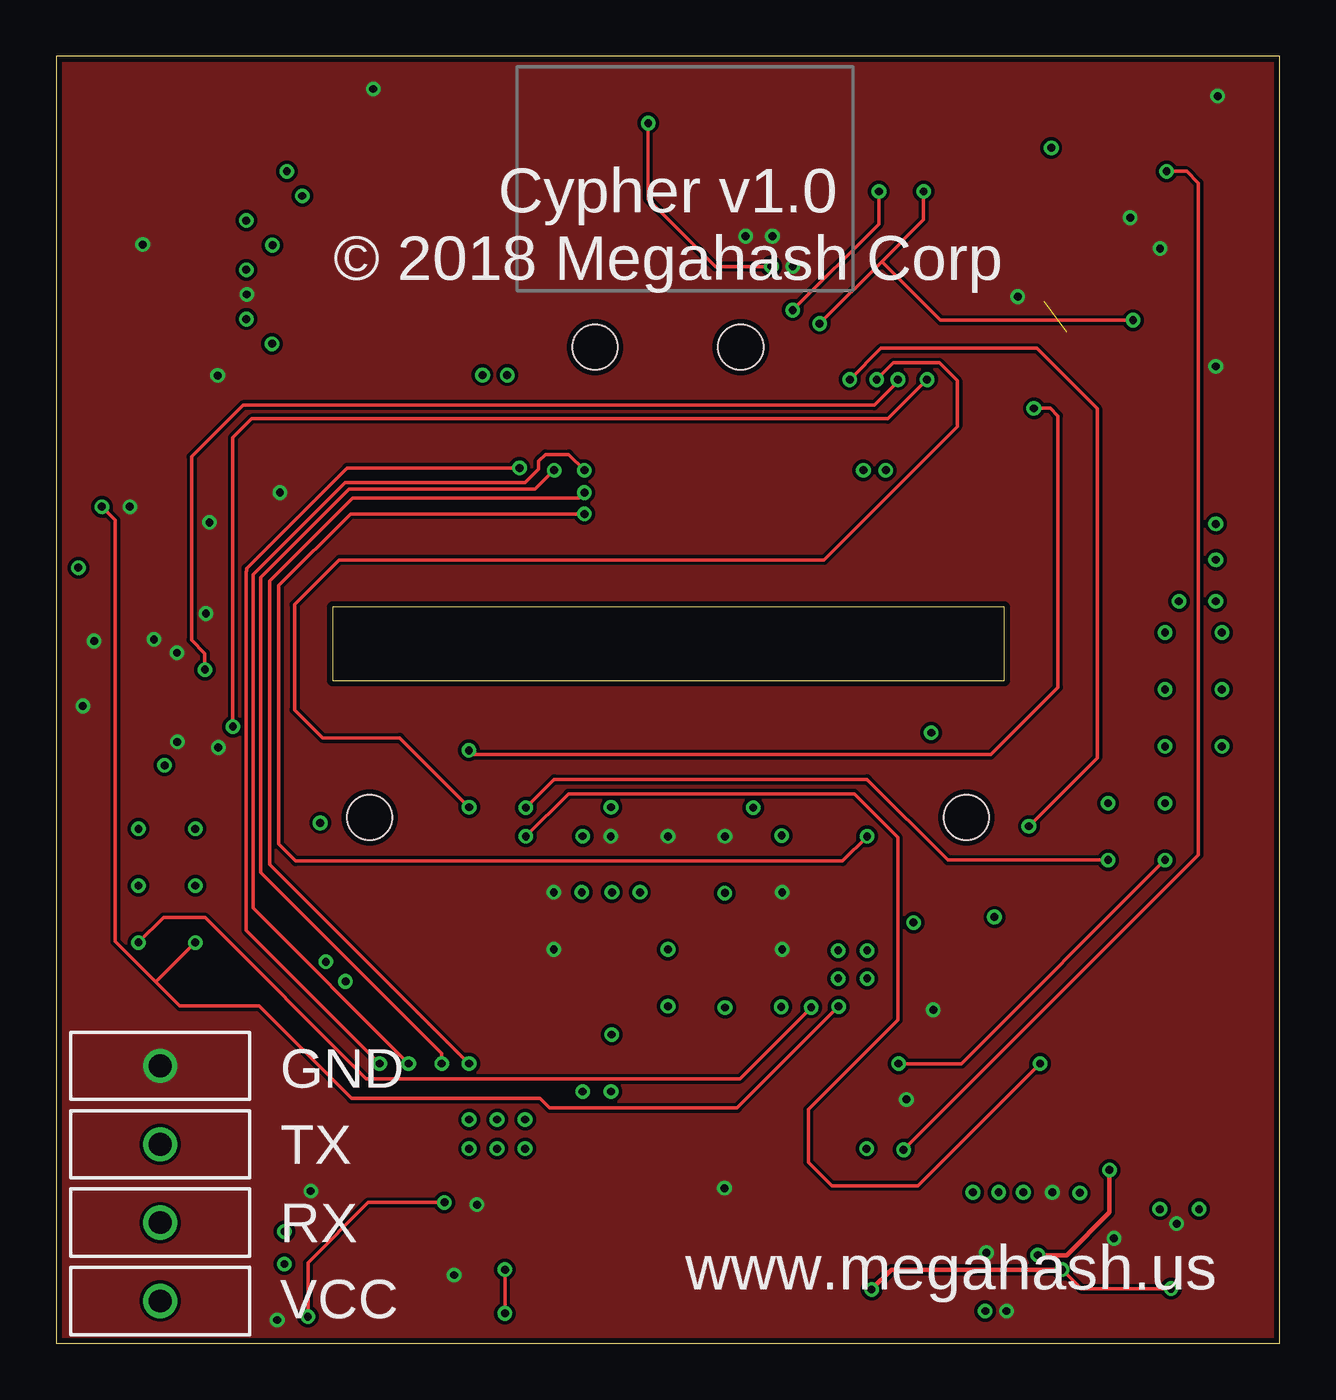
[diagram p7: board, top side]
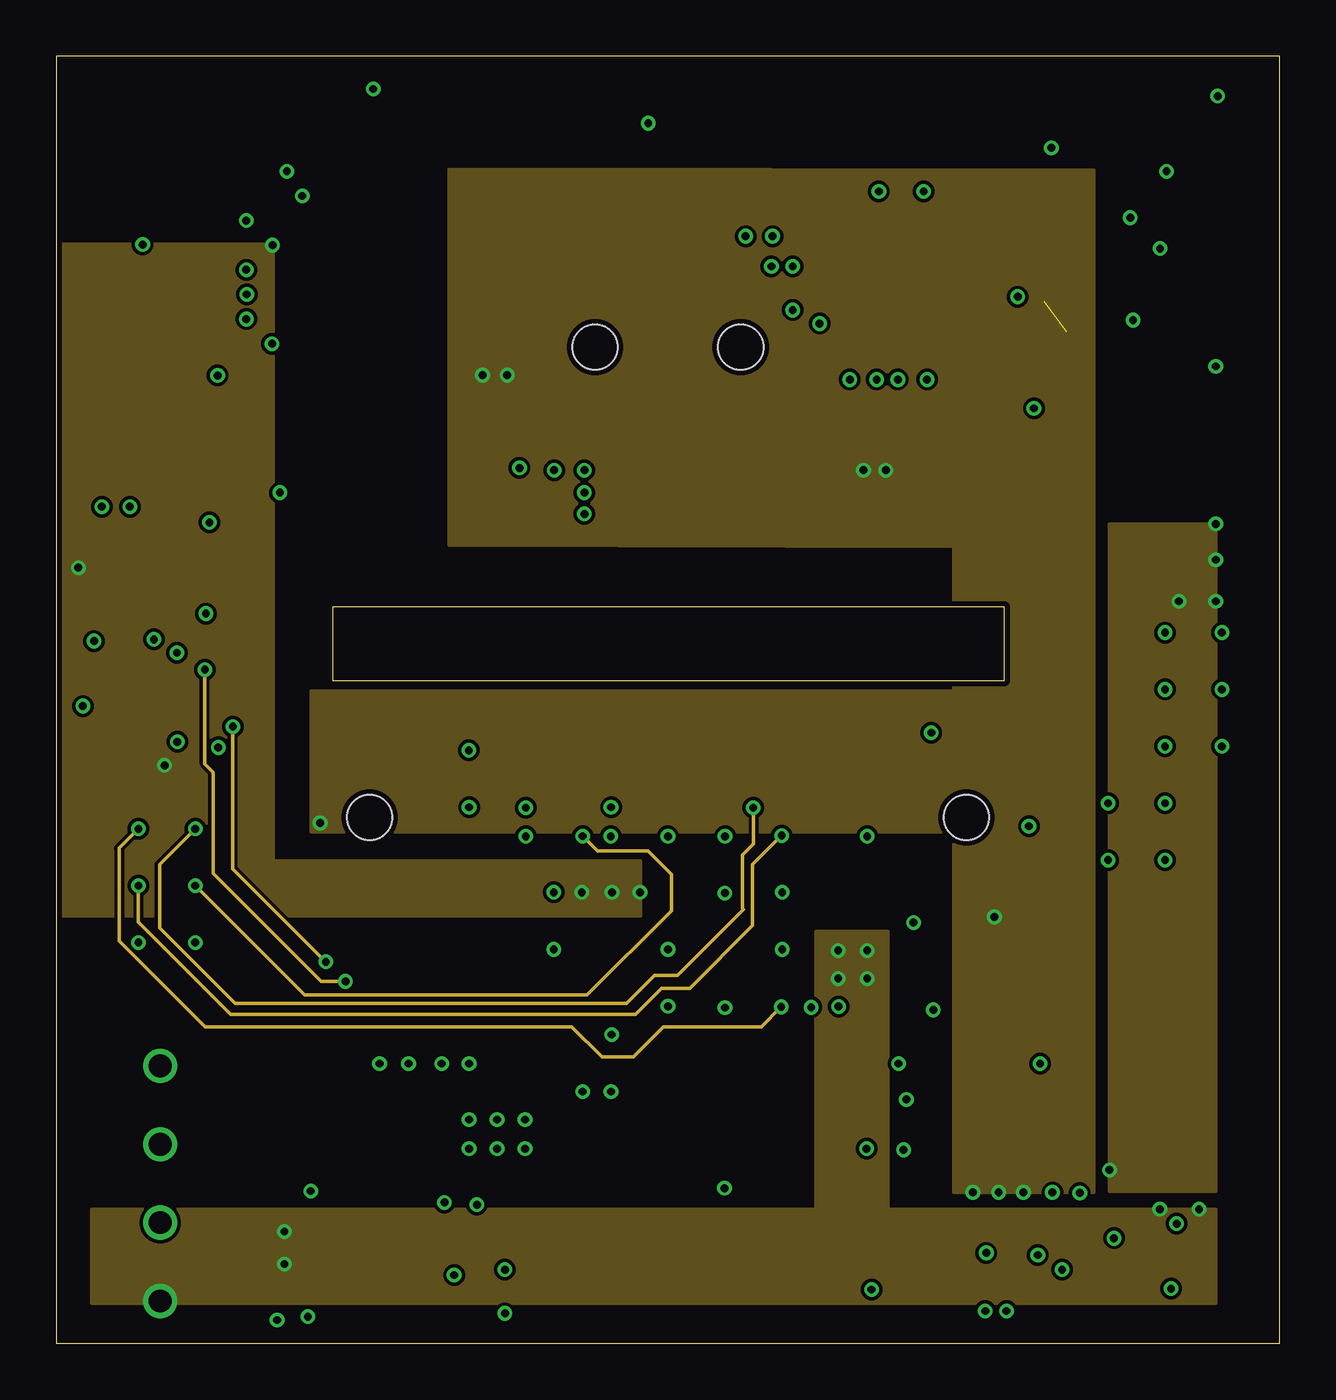
[diagram p8: board, inner layer VCC]
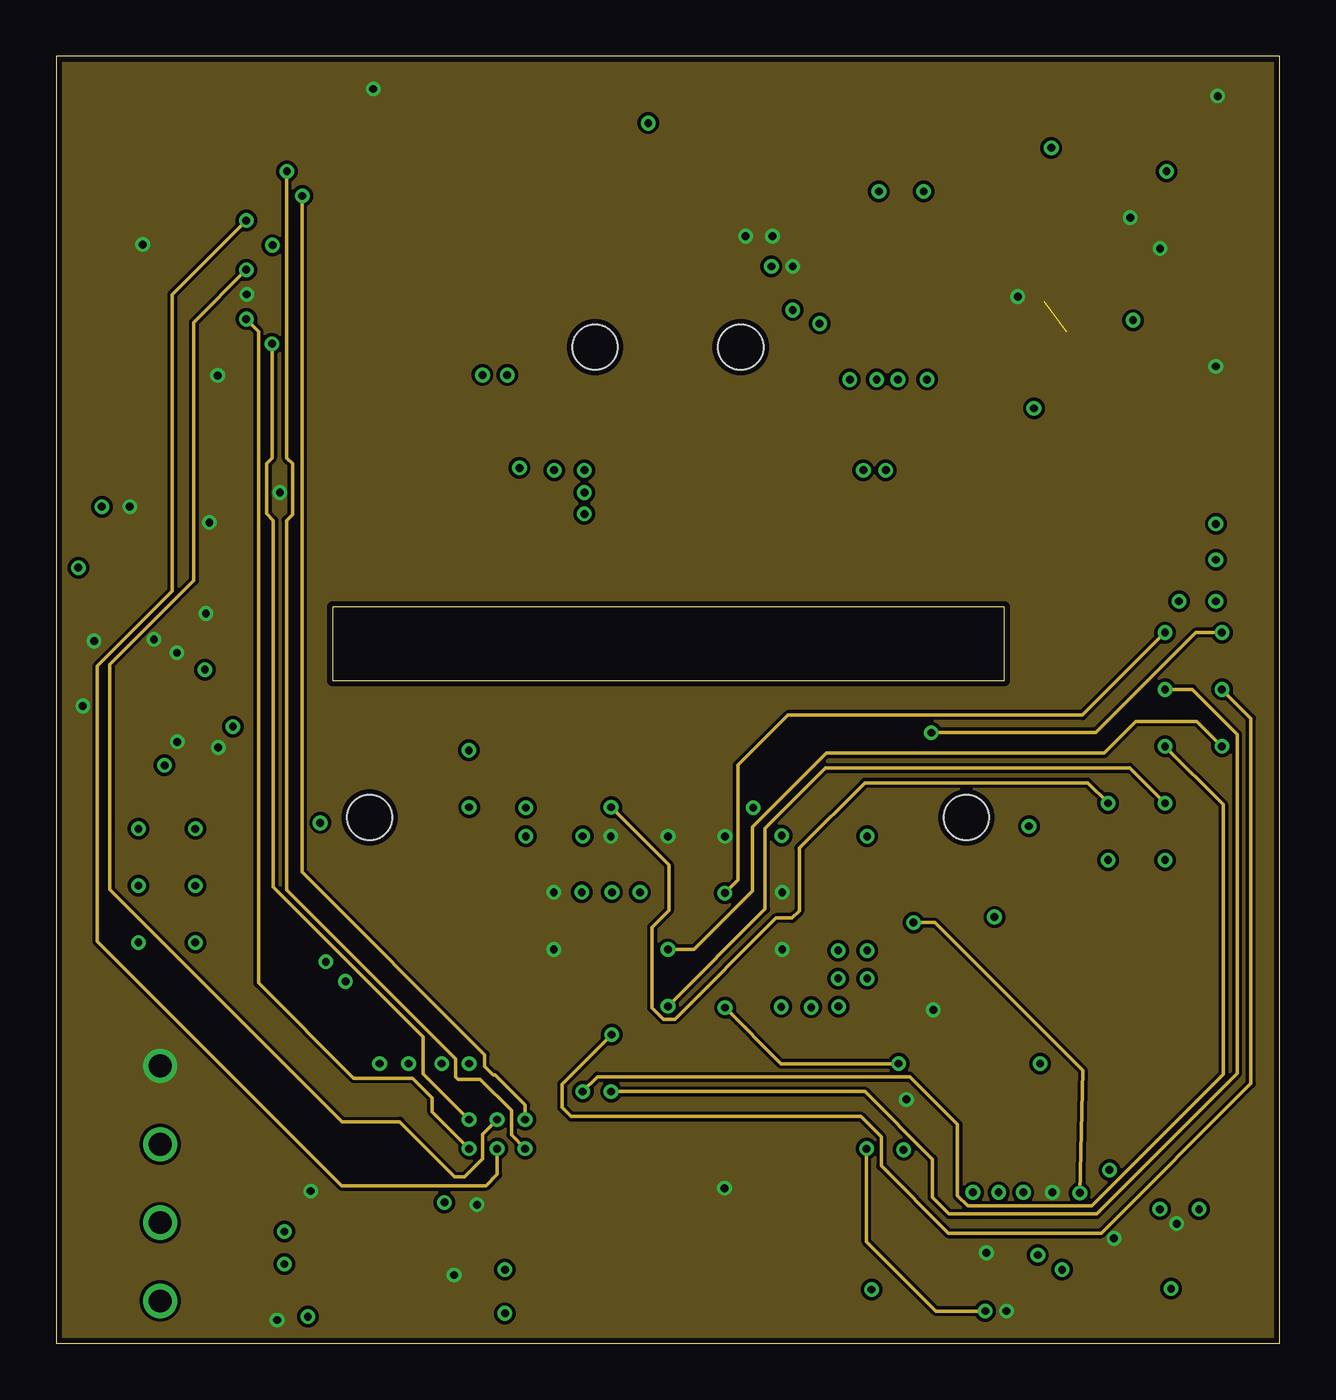
[diagram p9: board, inner layer Signal]
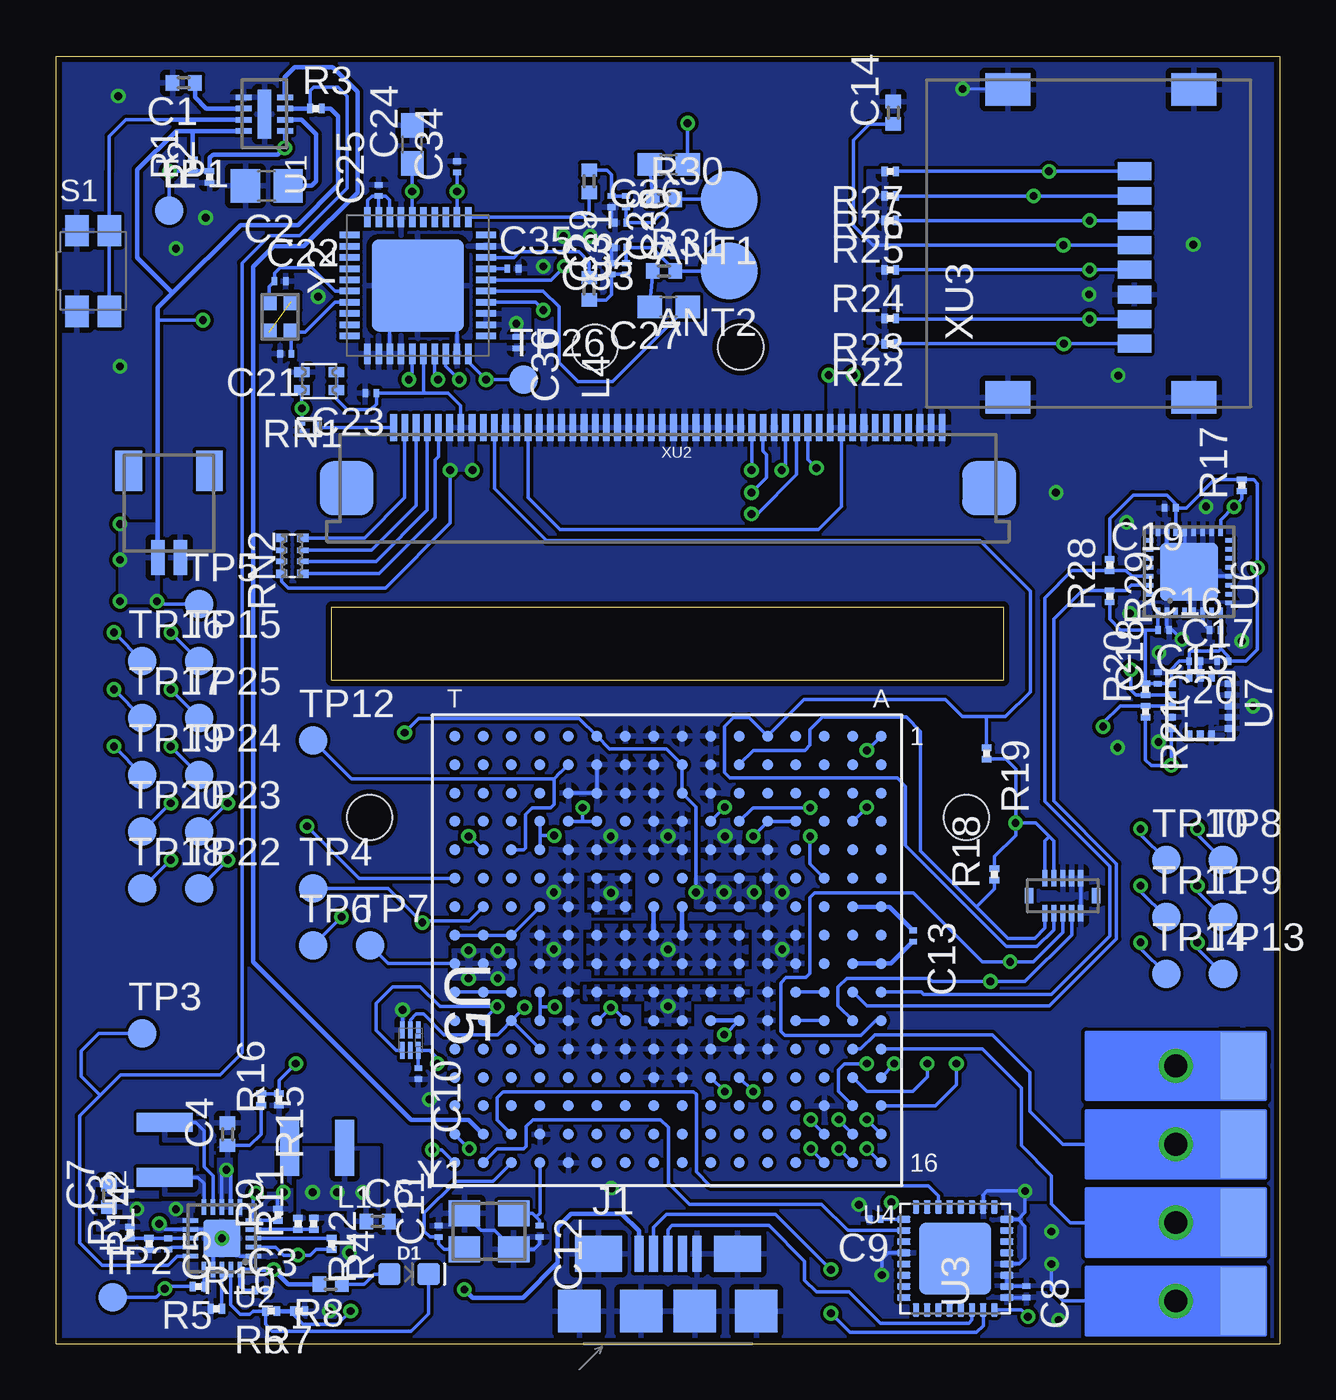
[diagram p10: board, bottom side, seen from below]

Size 54.66 x 57.5 mm. Coordinates in mm from the lower left corner, seen from the top.
Outline: 54.66,0 54.66,57.5 0,57.5 0,0 54.66,0
Outline: 12.35,32.9 12.35,29.6 42.35,29.6 42.35,32.9 12.35,32.9
Copper layers (1*2*15*16): Top 0.035mm / dielectric 0.23mm / VCC 0.035mm / dielectric 0.2mm / Signal 0.035mm / dielectric 0.23mm / Bottom 0.035mm
Design rules "MF_4_mil_drill_4_Layer *": minimum track width 5mil, minimum drill 4mil, track to track 6mil, track to pad 0.21mm, pad to pad 6mil, via to via 6mil, smd to smd 0mil, copper to edge 10mil, drill to drill 10mil, minimum pad ring 6mil, minimum via ring 6mil, stop-mask expansion 2mil, vias tented up to drill 2mm, thermal gap 10mil
Holes 2 mm at 24.08,44.5 30.58,44.5 14,23.5 40.66,23.5

### Footprints (pad centres in the part's own frame; a part is rotated, then mirrored left to right if it is on the bottom)
B2,54 = smd 2.54 x 2.54: TP 0,0
C0402 = smd 0.6 x 0.7: 1 -0.5,0; 2 0.5,0
C0805 = smd 1.3 x 1.5: 1 -0.95,0; 2 0.95,0
C0201 = smd 0.25 x 0.35: 1 -0.25,0; 2 0.25,0
C0603 = smd 1.1 x 1: 1 -0.85,0; 2 0.85,0
LED-0603 = smd 1 x 1: A -0.877,0; C 0.877,0
MICRO-USB-AB-SMD = smd 0.4 x 1.6: 1 -1.3,4; 2 -0.65,4; 3 0,4; 4 0.65,4; 5 1.3,4 | smd 2.1 x 1.6: PAD1 -3.1,4; PAD2 3.1,4 | smd 1.9 x 1.9: PAD3 -3.95,1.45; PAD4 -1.2,1.45; PAD5 1.2,1.45; PAD6 3.95,1.45
SH_CONNECTOR = smd 0.6 x 1.55: 1 0.5,4.775; 2 -0.5,4.775 | smd 1.2 x 1.8: PAD1 1.8,0.9; PAD2 -1.8,0.9
L2520 = smd 0.85 x 2.5: 1 1.225,0; 2 -1.225,0
3-XFDFN = smd 0.2 x 0.3: 1 0.175,0.325; 2 -0.175,0.325 | smd 0.55 x 0.3: 3 0,-0.325
R0201 = smd 0.28 x 0.43: 1 -0.255,0; 2 0.255,0
R0402 = smd 0.6 x 0.7: 1 -0.5,0; 2 0.5,0
EXBV4V = smd 0.45 x 0.7: 1 -0.4,-0.775; 2 0.4,-0.775; 3 0.4,0.775; 4 -0.4,0.775
EXBN8V = smd 0.38 x 0.5: 1 -0.8,-0.475; 4 0.8,-0.475; 5 0.8,0.475; 8 -0.8,0.475 | smd 0.25 x 0.5: 2 -0.25,-0.475; 3 0.25,-0.475; 6 0.25,0.475; 7 -0.25,0.475
EVQ-P7J01P = smd 1.4 x 1.05: 1 -1.8,0.725; 1' 1.8,0.725; 2 -1.8,-0.725; 2' 1.8,-0.725
B1,27 = smd 1.27 x 1.27: TP 0,0
UARTPINS = smd 2 x 3: GND -3,-5.25; RX -3,1.75; TX -3,-1.75; VCC -3,5.25
DFN8-3MMX2MM = smd 0.25 x 0.7: 1 -0.75,-0.925; 2 -0.25,-0.925; 3 0.25,-0.925; 4 0.75,-0.925; 5 0.75,0.925; 6 0.25,0.925; 7 -0.25,0.925; 8 -0.75,0.925 | smd 2.2 x 0.61: EXP 0,0
QFN20-3MM = smd 0.7 x 0.2: 1 -1.4,0.8; 2 -1.4,0.4; 3 -1.4,0; 4 -1.4,-0.4; 5 -1.4,-0.8; 11 1.4,-0.8; 12 1.4,-0.4; 13 1.4,0; 14 1.4,0.4; 15 1.4,0.8 | smd 0.2 x 0.7: 6 -0.8,-1.4; 7 -0.4,-1.4; 8 0,-1.4; 9 0.4,-1.4; 10 0.8,-1.4; 16 0.8,1.4; 17 0.4,1.4; 18 0,1.4; 19 -0.4,1.4; 20 -0.8,1.4 | smd 1.65 x 1.65: PAD 0,0
QFN32 = smd 0.6 x 0.3: 1 -2.3,1.75; 2 -2.3,1.25; 3 -2.3,0.75; 4 -2.3,0.25; 5 -2.3,-0.25; 6 -2.3,-0.75; 7 -2.3,-1.25; 8 -2.3,-1.75; 17 2.3,-1.75; 18 2.3,-1.25; 19 2.3,-0.75; 20 2.3,-0.25; 21 2.3,0.25; 22 2.3,0.75; 23 2.3,1.25; 24 2.3,1.75 | smd 0.3 x 0.6: 9 -1.75,-2.3; 10 -1.25,-2.3; 11 -0.75,-2.3; 12 -0.25,-2.3; 13 0.25,-2.3; 14 0.75,-2.3; 15 1.25,-2.3; 16 1.75,-2.3; 25 1.75,2.3; 26 1.25,2.3; 27 0.75,2.3; 28 0.25,2.3; 29 -0.25,2.3; 30 -0.75,2.3; 31 -1.25,2.3; 32 -1.75,2.3 | smd 3.2 x 3.2: EXP 0,0
OSD335X-BGA-256 = smd 0.5 x 0.5: A1 -9.525,-9.525; A2 -9.525,-8.255; A3 -9.525,-6.985; A4 -9.525,-5.715; A5 -9.525,-4.445; A6 -9.525,-3.175; A7 -9.525,-1.905; A8 -9.525,-0.635; A9 -9.525,0.635; A10 -9.525,1.905; A11 -9.525,3.175; A12 -9.525,4.445; A13 -9.525,5.715; A14 -9.525,6.985; A15 -9.525,8.255; A16 -9.525,9.525; B1 -8.255,-9.525; B2 -8.255,-8.255; B3 -8.255,-6.985; B4 -8.255,-5.715; B5 -8.255,-4.445; B6 -8.255,-3.175; B7 -8.255,-1.905; B8 -8.255,-0.635; B9 -8.255,0.635; B10 -8.255,1.905; B11 -8.255,3.175; B12 -8.255,4.445; B13 -8.255,5.715; B14 -8.255,6.985; B15 -8.255,8.255; B16 -8.255,9.525; C1 -6.985,-9.525; C2 -6.985,-8.255; C3 -6.985,-6.985; C4 -6.985,-5.715; C5 -6.985,-4.445; C6 -6.985,-3.175; C7 -6.985,-1.905; C8 -6.985,-0.635; C9 -6.985,0.635; C10 -6.985,1.905; C11 -6.985,3.175; C12 -6.985,4.445; C13 -6.985,5.715; C14 -6.985,6.985; C15 -6.985,8.255; C16 -6.985,9.525; D1 -5.715,-9.525; D2 -5.715,-8.255; D3 -5.715,-6.985; D4 -5.715,-5.715; D5 -5.715,-4.445; D6 -5.715,-3.175; D7 -5.715,-1.905; D8 -5.715,-0.635; D9 -5.715,0.635; D10 -5.715,1.905; D11 -5.715,3.175; D12 -5.715,4.445; D13 -5.715,5.715; D14 -5.715,6.985; D15 -5.715,8.255; D16 -5.715,9.525; E1 -4.445,-9.525; E2 -4.445,-8.255; E3 -4.445,-6.985; E4 -4.445,-5.715; E5 -4.445,-4.445; E6 -4.445,-3.175; E7 -4.445,-1.905; E8 -4.445,-0.635; E9 -4.445,0.635; E10 -4.445,1.905; E11 -4.445,3.175; E12 -4.445,4.445; E13 -4.445,5.715; E14 -4.445,6.985; E15 -4.445,8.255; E16 -4.445,9.525; F1 -3.175,-9.525; F2 -3.175,-8.255; F3 -3.175,-6.985; F4 -3.175,-5.715; F5 -3.175,-4.445; F6 -3.175,-3.175; F7 -3.175,-1.905; F8 -3.175,-0.635; F9 -3.175,0.635; F10 -3.175,1.905; F11 -3.175,3.175; F12 -3.175,4.445; F13 -3.175,5.715; F14 -3.175,6.985; F15 -3.175,8.255; F16 -3.175,9.525; G1 -1.905,-9.525; G2 -1.905,-8.255; G3 -1.905,-6.985; G4 -1.905,-5.715; G5 -1.905,-4.445; G6 -1.905,-3.175; G7 -1.905,-1.905; G8 -1.905,-0.635; G9 -1.905,0.635; G10 -1.905,1.905; G11 -1.905,3.175; G12 -1.905,4.445; G13 -1.905,5.715; G14 -1.905,6.985; G15 -1.905,8.255; G16 -1.905,9.525; H1 -0.635,-9.525; H2 -0.635,-8.255; H3 -0.635,-6.985; H4 -0.635,-5.715; H5 -0.635,-4.445; H6 -0.635,-3.175; H7 -0.635,-1.905; H8 -0.635,-0.635; H9 -0.635,0.635; H10 -0.635,1.905; H11 -0.635,3.175; H12 -0.635,4.445; H13 -0.635,5.715; H14 -0.635,6.985; H15 -0.635,8.255; H16 -0.635,9.525; J1 0.635,-9.525; J2 0.635,-8.255; J3 0.635,-6.985; J4 0.635,-5.715; J5 0.635,-4.445; J6 0.635,-3.175; J7 0.635,-1.905; J8 0.635,-0.635; J9 0.635,0.635; J10 0.635,1.905; J11 0.635,3.175; J12 0.635,4.445; J13 0.635,5.715; J14 0.635,6.985; J15 0.635,8.255; J16 0.635,9.525; K1 1.905,-9.525; K2 1.905,-8.255; K3 1.905,-6.985; K4 1.905,-5.715; K5 1.905,-4.445; K6 1.905,-3.175; K7 1.905,-1.905; K8 1.905,-0.635; K9 1.905,0.635; K10 1.905,1.905; K11 1.905,3.175; K12 1.905,4.445; K13 1.905,5.715; K14 1.905,6.985; K15 1.905,8.255; K16 1.905,9.525; L1 3.175,-9.525; L2 3.175,-8.255; L3 3.175,-6.985; L4 3.175,-5.715; L5 3.175,-4.445; L6 3.175,-3.175; L7 3.175,-1.905; L8 3.175,-0.635; L9 3.175,0.635; L10 3.175,1.905; L11 3.175,3.175; L12 3.175,4.445; L13 3.175,5.715; L14 3.175,6.985; L15 3.175,8.255; L16 3.175,9.525; M1 4.445,-9.525; M2 4.445,-8.255; M3 4.445,-6.985; M4 4.445,-5.715; M5 4.445,-4.445; M6 4.445,-3.175; M7 4.445,-1.905; M8 4.445,-0.635; M9 4.445,0.635; M10 4.445,1.905; M11 4.445,3.175; M12 4.445,4.445; M13 4.445,5.715; M14 4.445,6.985; M15 4.445,8.255; M16 4.445,9.525; N1 5.715,-9.525; N2 5.715,-8.255; N3 5.715,-6.985; N4 5.715,-5.715; N5 5.715,-4.445; N6 5.715,-3.175; N7 5.715,-1.905; N8 5.715,-0.635; N9 5.715,0.635; N10 5.715,1.905; N11 5.715,3.175; N12 5.715,4.445; N13 5.715,5.715; N14 5.715,6.985; N15 5.715,8.255; N16 5.715,9.525; P1 6.985,-9.525; P2 6.985,-8.255; P3 6.985,-6.985; P4 6.985,-5.715; P5 6.985,-4.445; P6 6.985,-3.175; P7 6.985,-1.905; P8 6.985,-0.635; P9 6.985,0.635; P10 6.985,1.905; P11 6.985,3.175; P12 6.985,4.445; P13 6.985,5.715; P14 6.985,6.985; P15 6.985,8.255; P16 6.985,9.525; R1 8.255,-9.525; R2 8.255,-8.255; R3 8.255,-6.985; R4 8.255,-5.715; R5 8.255,-4.445; R6 8.255,-3.175; R7 8.255,-1.905; R8 8.255,-0.635; R9 8.255,0.635; R10 8.255,1.905; R11 8.255,3.175; R12 8.255,4.445; R13 8.255,5.715; R14 8.255,6.985; R15 8.255,8.255; R16 8.255,9.525; T1 9.525,-9.525; T2 9.525,-8.255; T3 9.525,-6.985; T4 9.525,-5.715; T5 9.525,-4.445; T6 9.525,-3.175; T7 9.525,-1.905; T8 9.525,-0.635; T9 9.525,0.635; T10 9.525,1.905; T11 9.525,3.175; T12 9.525,4.445; T13 9.525,5.715; T14 9.525,6.985; T15 9.525,8.255; T16 9.525,9.525
SON35P100X100X40-6N = smd 0.762 x 0.203: 1 -0.457,0.356; 2 -0.457,0; 3 -0.457,-0.356; 4 0.457,-0.356; 5 0.457,0; 6 0.457,0.356
QFN32-4MM = smd 0.4 x 0.2: 1 -1.8,1.4; 2 -1.8,1; 3 -1.8,0.6; 4 -1.8,0.2; 5 -1.8,-0.2; 6 -1.8,-0.6; 7 -1.8,-1; 8 -1.8,-1.4; 17 1.8,-1.4; 18 1.8,-1; 19 1.8,-0.6; 20 1.8,-0.2; 21 1.8,0.2; 22 1.8,0.6; 23 1.8,1; 24 1.8,1.4 | smd 0.2 x 0.4: 9 -1.4,-1.8; 10 -1,-1.8; 11 -0.6,-1.8; 12 -0.2,-1.8; 13 0.2,-1.8; 14 0.6,-1.8; 15 1,-1.8; 16 1.4,-1.8; 25 1.4,1.8; 26 1,1.8; 27 0.6,1.8; 28 0.2,1.8; 29 -0.2,1.8; 30 -0.6,1.8; 31 -1,1.8; 32 -1.4,1.8 | smd 2.6 x 2.6: EXP 0,0
LGA-16 = smd 0.3 x 0.4: 1 1,1.3; 2 0.5,1.3; 3 0,1.3; 4 -0.5,1.3; 5 -1,1.3; 9 -1,-1.3; 10 -0.5,-1.3; 11 0,-1.3; 12 0.5,-1.3; 13 1,-1.3 | smd 0.4 x 0.3: 6 -1.3,0.5; 7 -1.3,0; 8 -1.3,-0.5; 14 1.3,-0.5; 15 1.3,0; 16 1.3,0.5
HVQFN40 = smd 0.9 x 0.29: 1 -3.05,2.25; 2 -3.05,1.75; 3 -3.05,1.25; 4 -3.05,0.75; 5 -3.05,0.25; 6 -3.05,-0.25; 7 -3.05,-0.75; 8 -3.05,-1.25; 9 -3.05,-1.75; 10 -3.05,-2.25; 21 3.05,-2.25; 22 3.05,-1.75; 23 3.05,-1.25; 24 3.05,-0.75; 25 3.05,-0.25; 26 3.05,0.25; 27 3.05,0.75; 28 3.05,1.25; 29 3.05,1.75; 30 3.05,2.25 | smd 0.29 x 0.9: 11 -2.25,-3.05; 12 -1.75,-3.05; 13 -1.25,-3.05; 14 -0.75,-3.05; 15 -0.25,-3.05; 16 0.25,-3.05; 17 0.75,-3.05; 18 1.25,-3.05; 19 1.75,-3.05; 20 2.25,-3.05; 31 2.25,3.05; 32 1.75,3.05; 33 1.25,3.05; 34 0.75,3.05; 35 0.25,3.05; 36 -0.25,3.05; 37 -0.75,3.05; 38 -1.25,3.05; 39 -1.75,3.05; 40 -2.25,3.05 | smd 4.1 x 4.1: EXP 0,0
DF37B-10DM-0.4V = smd 0.23 x 0.73: 1 -0.8,-0.775; 2 -0.4,-0.775; 3 0,-0.775; 4 0.4,-0.775; 5 0.8,-0.775; 6 0.8,0.775; 7 0.4,0.775; 8 0,0.775; 9 -0.4,0.775; 10 -0.8,0.775 | smd 0.38 x 0.68: PADA 1.5,0; PADB -1.5,0
FPC/FFC_50PIN_0.5MMPITCH = smd 0.3 x 1.2: 1 -12.25,40.9; 2 -11.75,40.9; 3 -11.25,40.9; 4 -10.75,40.9; 5 -10.25,40.9; 6 -9.75,40.9; 7 -9.25,40.9; 8 -8.75,40.9; 9 -8.25,40.9; 10 -7.75,40.9; 11 -7.25,40.9; 12 -6.75,40.9; 13 -6.25,40.9; 14 -5.75,40.9; 15 -5.25,40.9; 16 -4.75,40.9; 17 -4.25,40.9; 18 -3.75,40.9; 19 -3.25,40.9; 20 -2.75,40.9; 21 -2.25,40.9; 22 -1.75,40.9; 23 -1.25,40.9; 24 -0.75,40.9; 25 -0.25,40.9; 26 0.25,40.9; 27 0.75,40.9; 28 1.25,40.9; 29 1.75,40.9; 30 2.25,40.9; 31 2.75,40.9; 32 3.25,40.9; 33 3.75,40.9; 34 4.25,40.9; 35 4.75,40.9; 36 5.25,40.9; 37 5.75,40.9; 38 6.25,40.9; 39 6.75,40.9; 40 7.25,40.9; 41 7.75,40.9; 42 8.25,40.9; 43 8.75,40.9; 44 9.25,40.9; 45 9.75,40.9; 46 10.25,40.9; 47 10.75,40.9; 48 11.25,40.9; 49 11.75,40.9; 50 12.25,40.9 | smd 2.4 x 2.4: PADA -14.35,38.2; PADB 14.35,38.2
HINGED_LID_MICROSD = smd 0.8 x 1.5: 1 3.225,-1.5; 2 2.125,-1.5; 3 1.025,-1.5; 4 -0.075,-1.5; 5 -1.175,-1.5; 6 -2.275,-1.5; 7 -3.375,-1.5; 8 -4.475,-1.5 | smd 1.45 x 2: G1 6.875,-4.15; G2 6.875,4.15; G3 -6.875,4.15; G4 -6.875,-4.15
4-SMD = smd 1.4 x 1.15: 1 -1.1,-0.8; 2 1.1,-0.8; 3 1.1,0.8; 4 -1.1,0.8
XRCGB = smd 0.75 x 0.7: 1 -0.675,-0.5; 2 0.675,-0.5; 3 0.675,0.5; 4 -0.675,0.5

### Placement (x,y rotation side)
ANT1  24.6,51.1 180 bottom
ANT2  24.6,47.9 180 bottom
C1  48.95,56.3 180 bottom
C2  45.25,51.7 180 bottom
C3  45.51,2.37 0 bottom
C4  47,9.35 90 bottom
C5  49.65,4.45 270 bottom
C6  40.3,5.45 0 bottom
C7  52.3,6.6 90 bottom
C8  11.33,2.31 270 bottom
C9  18.08,5.56 180 bottom
C10  38.48,12.05 270 bottom
C11  37.57,5.01 90 bottom
C12  33.07,5.01 270 bottom
C13  16.38,18.2 270 bottom
C14  17.27,54.96 90 bottom
C15  2.9,31.87 180 bottom
C16  5.2,31.87 0 bottom
C17  3.8,30.47 0 bottom
C18  5.45,29.72 90 bottom
C19  4.9,37.32 180 bottom
C20  2.55,30.47 180 bottom
C21  44.4,44.2 180 bottom
C22  44.65,47.45 0 bottom
C23  40.6,42.45 180 bottom
C24  38.75,53.55 90 bottom
C25  40.25,51.5 90 bottom
C26  27.3,52.65 180 bottom
C27  27.3,46.3 180 bottom
C28  29.85,51 270 bottom
C29  29.85,48 90 bottom
C30  29.2,51 270 bottom
C31  29.2,48 90 bottom
C32  29.45,50.05 180 bottom
C33  29.45,48.95 180 bottom
C34  36.75,52.55 90 bottom
C35  34.25,48 0 bottom
C36  34.1,44.7 270 bottom
D1  38.9,3.1 0 bottom
J1  27.33,0 0 bottom
J2  49.61,39.88 180 bottom
L1  43,8.75 180 bottom
L2  49.8,8.65 90 bottom
L3  30.85,51.9 90 bottom
L4  30.85,47.1 270 bottom
Q1  43.35,40.92 90 bottom
R1  48.55,52.6 90 bottom
R2  47.8,52.1 90 bottom
R3  43.05,55.15 0 bottom
R4  42.35,4.45 270 bottom
R5  48.3,2.55 180 bottom
R6  45.05,1.45 180 bottom
R7  43.8,1.45 180 bottom
R8  42.4,2.65 180 bottom
R9  44.75,5.75 90 bottom
R10  47.5,1.55 0 bottom
R11  43.85,5.35 90 bottom
R12  43.15,5.35 270 bottom
R13  51.35,4.95 90 bottom
R14  50.5,4.45 90 bottom
R15  45.5,10.9 270 bottom
R16  44.7,10.9 90 bottom
R17  1.7,38.32 90 bottom
R18  12.75,20.95 90 bottom
R19  13.1,26.35 270 bottom
R20  6,29.22 90 bottom
R21  6,28.22 270 bottom
R22  17.4,44.65 180 bottom
R23  17.4,45.78 180 bottom
R24  17.4,47.95 180 bottom
R25  17.4,50.15 180 bottom
R26  17.4,51.25 180 bottom
R27  17.4,52.35 180 bottom
R28  7.6,33.37 90 bottom
R29  7.6,34.77 270 bottom
R30  27.5,51.1 0 bottom
R31  27.5,47.9 0 bottom
RN1  42.91,42.98 90 bottom
RN2  44.11,35.18 270 bottom
S1  53,47.9 270 bottom
TP1  49.6,50.6 0 bottom
TP2  52.12,2.06 0 bottom
TP3  50.8,13.86 0 bottom
TP4  43.18,20.32 0 bottom
TP5  48.26,33.02 0 bottom
TP6  43.18,17.78 0 bottom
TP7  40.64,17.78 0 bottom
TP8  2.54,21.59 0 bottom
TP9  2.54,19.05 0 bottom
TP10  5.08,21.59 0 bottom
TP11  5.08,19.05 0 bottom
TP12  43.18,26.94 0 bottom
TP13  2.54,16.51 0 bottom
TP14  5.08,16.51 0 bottom
TP15  48.26,30.48 0 bottom
TP16  50.8,30.48 0 bottom
TP17  50.8,27.94 0 bottom
TP18  50.8,20.32 0 bottom
TP19  50.8,25.4 0 bottom
TP20  50.8,22.86 0 bottom
TP21  4.65,7.15 180 bottom
TP22  48.26,20.32 0 bottom
TP23  48.26,22.86 0 bottom
TP24  48.26,25.4 0 bottom
TP25  48.26,27.94 0 bottom
TP26  33.78,43.05 0 bottom
U1  45.35,54.9 270 bottom
U2  47.25,4.7 180 bottom
U3  14.5,3.8 0 bottom
U4  27.33,17.6 180 bottom
U5  38.83,13.55 270 bottom
U6  4.05,34.47 90 bottom
U7  3.56,28.47 90 bottom
U8  38.5,47.25 90 bottom
XU1  9.7,20 0 bottom
XU2  27.33,0 0 bottom
XU3  8,49.12 90 bottom
Y1  35.32,5.01 0 bottom
Y2  44.65,45.85 270 bottom

### Tracks (layer width: path | path; a pad name or v marks a point on that pad's centre or on a via)
3V3  (via drill 0.35)
  Signal 0.152: v52.07,31.75 50.9,31.75 46.43,27.28 v39.09,27.28
  Bottom 0.15: C16.1 6,31.87 R20.2 | U7.5 v4.85,25.82 5.75,25.82 6,26.07 R21.2 | 3.48,30.92 4.05,30.92 C17.1 | v26.08,20.15 26.08,23.97 U4.H3 U4.H2 27.39,26.55 29.93,26.55 U4.L1
  Bottom 0.152: R20.2 C18.1 U7.1 4.86,30.1 4.49,30.47 C17.1 4.06,30.51 U7.16 | C16.1 U6.1 | U6.8 C15.1 2.66,31.05 | C19.1 U6.22 | C19.1 4.18,37.32 2.92,38.58 R17.2 1.18,38.58 1,38.4 v1,34.65 1,31 1.53,30.47 C20.1 2.3,30.69 2.66,31.05 | R29.1 7.6,36.85 6.55,37.9 5.05,37.9 4.65,37.5 C19.1 | R28.1 7.6,32.35 7.12,31.87 6,31.87 | 2.66,31.05 2.66,31 2.74,30.92 3.48,30.92 | TP16.TP v52.07,31.75 | v39.09,27.28 38.46,27.91 31.3,27.91 U4.L1 | C14.1 18.34,54.46 19.05,53.75 19.05,49.92 18.18,49.05 v9.67,49.05 XU3.4
  other vias: 24.83,20.15 23.48,20.15
  pour Bottom: 26.08,20.8 23.48,20.8 23.48,19.5 26.08,19.5
  pour Bottom: 17.56,44.68 18.41,44.68 18.41,52.38 17.56,52.38
  pour VCC: 0.05,49.1 9.7,49.1 9.7,21.55 26.1,21.55 26.1,19.1 0.05,19.1
#RESET  (via drill 0.35)
  Top 0.152: v34.95,15.05 30.42,10.52 22.05,10.52 21.61,10.95 13.2,10.95 9.07,15.07 5.53,15.07 4.46,16.14 | v2.05,37.37 2.65,36.77 2.65,17.95 4.46,16.14 | v6.22,17.91 4.46,16.14
  Bottom 0.15: 39.47,13.09 U5.4
  Bottom 0.152: U4.R11 v34.96,15.05 v34.95,15.05 37.51,15.05 38.39,15.93 39.62,15.93 40.36,15.19 40.36,13.98 39.47,13.09 | R17.1 1.7,37.72 v2.05,37.37 2.65,36.77 U6.17 | TP14.TP 6.22,17.65 v6.22,17.91
AIN.VREF+
  Bottom 0.2: U4.B7 U4.A7 17.43,19.5 C13.1
AIN.VREF-
  Bottom 0.2: C13.2 17.36,16.96 U4.A9 U4.B9
ANT_1
  Bottom 0.152: C30.2 C32.1 28.05,50.05 R30.2 ANT1.TP
ANT_2
  Bottom 0.152: C31.2 C33.1 28.05,48.95 R31.2 ANT2.TP
BAT_V+  (via drill 0.35)
  Top 0.152: v38.75,51.45 38.75,50.2 36.88,48.33 | 36.88,48.33 v34.1,45.55 | 36.88,48.33 39.5,45.7 v48.1,45.7
  Top 0.2: v43.85,3.95 45.15,3.95 47.05,5.85 v47.05,7.75
  Bottom 0.15: U2.2 44.85,4.3 44.5,3.95 v43.85,3.95 43.3,3.95 43.05,4.2
  Bottom 0.152: R4.2 43.05,4.2 | U8.26 v38.75,51.45 C24.1 | v48.1,45.7 50.11,45.7 | TP5.TP 50.02,33.02 v50.15,33.15 | U2.7 46.85,7.55 v47.05,7.75 47.25,7.55 U2.8 | R15.2 45.5,9.35 46,8.85 C4.1
  Bottom 0.2: U1.4 48.55,54.15 | 48.55,54.15 49.3,54.15 51.02,52.42 51.02,48.48 49.46,46.92 49.45,46.92 | R1.2 48.55,54.15 | R3.2 42.4,55.15 42.05,54.8 42.05,51.75 43.85,49.95 46.42,49.95 49.45,46.92 | J2.1 50.11,45.7 50.11,46.26 49.45,46.92
  other vias: 51.8,36.6 51.8,35 51.8,33.15
  pour Bottom: 47.4,5.85 47.4,8.75 46.83,8.75 46.83,5.85
  pour Bottom: 50.1,36.6 51.8,36.6 51.8,33.1 50.1,33.1
  pour VCC: 51.8,36.6 51.8,6.8 47.05,6.8 47.05,36.6
  pour Bottom: 33.5,46.2 35.8,46.2 35.8,44.9 33.5,44.9
CHRG  (via drill 0.35)
  Signal 0.152: v36.2,8.7 36.2,4.55 39.3,1.45 v41.5,1.45
  Bottom 0.152: v36.2,8.7 v36.21,8.7 U4.T15 | R7.2 44.05,1.28 43.63,0.85 42.09,0.85 v41.5,1.45
  Bottom 0.2: R6.1 R7.2
CHRG+
  Bottom 0.152: D1.C 38.02,1.33 38.8,0.55 45,0.55 45.3,0.85 R6.2 45.85,1.45 46,1.3 46.43,1.3 46.85,1.72 U2.19
EEPROM.WP
  Bottom 0.15: 33.78,22.05 U4.P5 | U4.M2 32.13,25.5
  Bottom 0.152: TP12.TP 41.46,25.22 32.45,25.22 32.43,25.2 | 32.43,25.2 32.43,25.21 32.14,25.5 32.13,25.5 | 32.43,25.2 32.43,24.07 32.58,23.92 33.4,23.92 33.7,23.62 33.7,22.14 33.78,22.05
EMCF_ANTM1
  Bottom 0.152: C30.1 C28.1 29.85,52.2 30.05,52.4 L3.2
EMCF_ANTM2
  Bottom 0.152: C31.1 C29.1 29.85,46.85 30.1,46.6 L4.2
EN
  Bottom 0.152: U2.15 49.25,3.9 49.65,3.5 52.6,3.5 53.6,4.5 53.6,10.16 52.69,11.08 | R3.1 43.3,55.95 43.15,56.1 42.05,56.1 41.65,55.7 41.65,51.6 43.77,49.48 45.12,49.48 46.35,48.25 46.35,12.98 47.33,12 51.77,12 52.69,11.08 | TP3.TP 52.74,13.86 53.53,13.07 53.53,11.92 52.69,11.08
  Bottom 0.2: R3.1 U1.7
EN_LDO  (via drill 0.35)
  Signal 0.152: v45.72,6.72 45.85,12.2 39.25,18.8 v38.3,18.8
  Bottom 0.152: R9.1 U2.5 45.85,6.6 v45.72,6.72 | U4.R7 36.12,18.97 36.22,18.87 38.23,18.87 v38.3,18.8 39.82,20.32 TP4.TP
FB1
  Bottom 0.15: U2.4 44.05,5.1 R11.1 R12.2
FB2
  Bottom 0.152: U2.13 C5.1 R14.2 51.34,4.7 R13.1
GND  (via drill 0.35, 1.02)
  Bottom 0.15: v39.18,14.9 39.18,14.06 U5.3 | C12.2 33.07,4.46 33.32,4.21 Y1.2 35.07,5.06 35.67,5.06 Y1.4 | U2.12 49.8,5.1 v50.05,5.35 | U3.17 C8.2 | v17.78,3.06 17.78,3.76 17.48,4.06 | U3.24 11.69,5.55 | 11.69,5.55 11.38,5.86 v11.38,6.81 12.78,6.81 | 11.69,5.55 11.38,5.24 11.38,3.81 11.64,3.55 U3.20 | R9.2 44.75,6.5 v44.5,6.75 | XU3.G2 v14.17,56.03 | U6.12 3.85,34.27 U6.EXP | U4.L2 U4.L3 U4.M3
  Bottom 0.152: 17.48,4.06 U3.4 | C8.2 | U2.12 47.65,5.1 U2.PAD | U2.1 46.45,3.9 U2.PAD | U7.15 3.56,30.51 C17.2 | C28.2 29.85,50.2 C32.2 | C29.2 29.85,48.8 C33.2 | U3.26 13.25,6.62 13.26,6.63 13.08,6.81 12.78,6.81 | U6.2 5.05,31.97 C16.2 4.8,31.87 v4.38,31.45 | XU1.6 XU1.5 | U8.9 36.75,45.5 U8.EXP 39.75,46 U8.3 | U6.23 5.05,35.47 U6.EXP 4.25,34.67 U6.21 | C15.2 3.45,32.17 U6.6 | U2.PAD 47.65,4.7 U2.17
  other vias: 37.98,10.9 22.23,17.6 22.23,20.15 32.43,20.15 32.43,17.6 29.88,22.65 27.33,22.65 24.78,22.65 8.52,46.85 7.22,43.23 3.87,49.08 1.2,28.47 5.42,26.87 3.3,37.37 6.7,32.6 6.85,36.67 1.7,31.37 42.45,1.45 49.3,48.9 47.98,50.28 41.55,4.05 18.8,6.2 5.4,30.85 51.88,55.71 51.8,43.64 7.25,26.62 10,38 9.88,1.05 30.8,49.45 32,49.45 42.95,46.75 32.9,48.1 47.25,4.7 4.65,12.4 29.86,6.93
  pour Bottom (rank 2): 32.43,22.65 32.43,18.25 33.08,18.25 33.08,16.9 31.88,16.9 31.88,13.1 27.98,13.1 27.98,11.85 26.68,11.85 26.68,13.1 22.88,13.1 22.88,16.9 21.58,16.9 21.58,18.25 22.23,18.25 22.23,22.65 26.68,22.65 26.68,23.35 28.03,23.35 28.03,22.65
  pour Bottom (rank 6): 0,57.5 0,0 54.65,0 54.65,57.5
  pour Top: 0,57.15 54.5,57.15 54.5,0 0,0
  pour Signal: 0,57.5 0,0 54.66,0 54.66,57.5
  cutout Bottom: 43.75,46.8 45.45,46.8 45.45,44.85 43.75,44.85
  pour Bottom (isolate 0.21, rank 2): 16.9,28.05 37.9,28.05 37.9,7.1 16.9,7.1
HPWR
  Bottom 0.15: U2.16 48.05,2.35 R5.1
I2C0_SCL
  Bottom 0.152: U4.C10 U4.D10
I2C0_SDA
  Bottom 0.152: U4.D11 U4.C11
I2C1_SCL  (via drill 0.35)
  Top 0.152: v6.65,30.09 6.65,30.82 6.05,31.42 6.05,39.6 8.35,41.9 36.55,41.9 37.6,42.95 v37.6,43.05
  VCC 0.152: v6.65,30.09 6.65,25.88 7.02,25.51 7.02,20.99 11.84,16.17 v12.93,16.17
  Bottom 0.152: U7.2 R20.1 6.43,28.96 6.65,29.18 v6.65,30.09 | XU1.4 9.3,18.25 11.38,16.17 v12.93,16.17 15.53,16.17 15.67,16.32 19.34,16.32 19.73,15.93 19.73,15.08 U4.B11 | U8.7 37.75,43.2 v37.6,43.05
I2C1_SDA  (via drill 0.35)
  Top 0.152: v7.9,27.55 7.9,40.45 8.75,41.3 37.15,41.3 v38.9,43.05
  VCC 0.152: v7.9,27.55 7.9,21.2 v12.05,17.05
  Bottom 0.152: U7.3 R21.1 7.12,28.48 7.9,27.7 v7.9,27.55 | XU1.3 9.7,18.37 11.02,17.05 v12.05,17.05 13.29,17.05 16.36,20.12 20.79,20.12 20.99,19.92 20.99,16.52 21.17,16.34 22.05,16.34 22.29,16.11 22.29,13.95 22.11,13.77 18.7,13.77 18.05,14.43 U4.A11 | U8.5 38.75,43.2 v38.9,43.05
INT
  Bottom 0.2: U1.8 44.45,55.67 44.45,56.55 44,57 42.3,57 41.2,55.9 41.2,51.4 43.6,49 44.95,49 45.85,48.1 45.85,17.05 38.8,10 36.24,10 U4.R15
KILL  (via drill 0.35)
  Top 0.152: v49.6,52.35 50.49,52.35 51.02,51.82 51.02,21.82 v37.85,8.65
  Bottom 0.15: 48.54,52.35 R1.1
  Bottom 0.152: U4.T16 37.43,8.65 v37.85,8.65 | R1.1 v49.59,52.34 v49.6,52.35 TP1.TP
  Bottom 0.2: U1.5 44.42,53.42 v44.45,53.4 44.75,53.1 47.65,53.1 47.8,52.95 R2.2 48.54,52.35
LCD_CLK  (via drill 0.35)
  Top 0.152: v22.25,39 21.4,38.15 13.1,38.15 9.15,34.2 9.15,21.03 17.23,12.95 v17.23,12.5
  Bottom 0.152: v22.25,39 22.08,39.17 XU2.36 | U4.A13 17.23,12.46 v17.23,12.5
LCD_CS  (via drill 0.35)
  Top 0.152: v14.45,12.5 8.49,18.45 8.49,34.48 8.52,34.5 8.52,34.62 13,39.1 v20.7,39.1
  Bottom 0.152: v20.7,39.1 21.08,39.48 XU2.38 | v14.45,12.5 14.45,11.54 15.38,10.62 U4.A14
LCD_D/C  (via drill 0.35)
  Top 0.152: v36.23,22.65 35.13,21.55 10.7,21.55 9.95,22.3 9.95,33.85 13.15,37.05 v23.6,37.05
  Bottom 0.152: U4.R5 36.19,22.65 v36.23,22.65 | XU2.37 21.58,38.81 23.34,37.05 v23.6,37.05
LCD_MISO  (via drill 0.35)
  Top 0.152: v15.75,12.5 8.8,19.45 8.8,34.35 12.9,38.45 20.95,38.45 21.55,39.05 21.55,39.4 21.86,39.7 22.89,39.7 v23.6,39
  Bottom 0.152: v23.6,39 23.58,39.02 XU2.33 | U4.B13 18.44,11.25 16.4,11.25 15.75,11.9 v15.75,12.5
LCD_MOSI  (via drill 0.35)
  Top 0.152: v18.45,12.5 9.55,21.4 9.55,34.05 13.25,37.75 23.35,37.75 v23.6,38
  Bottom 0.152: XU2.34 23.08,39.85 22.94,39.71 22.94,38.66 v23.6,38 | U4.B14 19.71,11.26 19.71,12.23 19.45,12.5 v18.45,12.5
LCD_RESET
  Bottom 0.152: XU2.10 35.08,38.18 32.75,35.85 13.4,35.85 11.15,33.6 11.15,29.1 12.25,28 13.15,28 | R19.1 13.1,27.95 13.15,28 | XU1.2 10.1,18.48 10.85,17.73 12.22,17.73 16.35,21.86 16.35,21.87 16.72,22.24 16.72,24.89 17.09,25.25 24.55,25.25 24.8,25.5 24.8,27.56 24.4,27.96 23.72,27.96 U4.E1 21.25,28.75 14.95,28.75 14.19,28 13.15,28
LDO_3V3  (via drill 0.35)
  Bottom 0.152: XU1.9 10.1,22.45 10.3,22.65 | 10.3,22.65 10.9,23.25 v11.8,23.25 | XU1.10 10.5,22.45 10.3,22.65 | v11.8,23.25 11.8,22.7 12.75,21.75 R18.2 | v11.8,23.25 11.8,25.65 12.24,26.09 R19.2 | XU2.13 33.58,37.78 32.15,36.35 20.6,36.35 19.58,37.37 XU2.41 | XU2.7 36.58,41.88 37.15,42.45 38.25,42.45 | U8.6 38.25,42.45 | RN2.1 RN2.2 RN2.3 RN2.4 44.59,34.03 44.3,33.75 39.95,33.75 37.06,36.64 v37.06,39 | RN1.2 RN1.1 42.13,42.19 41.65,41.7 40.6,41.7 40.35,41.95 C23.1 38.25,42.45 | TP6.TP v41.91,19.05
  other vias: 43.2,6.75 42.1,6.75 40.95,6.75 19.05,43.25 20.15,43.25 36.06,39
  pour Bottom (rank 3): 43.85,5.45 43.85,8.75 40.25,8.75 40.25,5.4 41.6,5.4 41.6,6 43.5,6 43.5,5.45
  pour VCC: 40.1,6.75 46.35,6.75 46.35,52.4 17.55,52.45 17.55,35.65 40.1,35.6
  pour Bottom: 19.05,40.85 19.05,43.25 20.15,43.25 20.15,40.85
  pour Bottom: 37.11,41.4 37.11,39 36.06,39 36.06,41.4
  pour VCC: 11.4,22.85 11.4,29.15 40.1,29.15 40.1,22.85
LDO_BOOSTER_MODE
  Bottom 0.152: R4.1 42.45,4.7 44.28,4.7 45.27,4.7 U2.3
LED_A
  Bottom 0.152: D1.A 40.45,3.1 40.9,2.65 R8.1
LEDA@2
  Bottom 0.152: XU2.2 39.08,37.77 40.87,35.98 RN2.8
LEDA@3
  Bottom 0.152: XU2.3 38.58,37.42 40.57,35.43 RN2.7
LEDA@4
  Bottom 0.152: XU2.4 38.08,37.22 40.37,34.93 RN2.6
LEDA@5
  Bottom 0.152: RN2.5 40.22,34.38 37.72,36.88 37.72,39.46 37.58,39.6 XU2.5
LEDK
  Bottom 0.152: Q1.3 43.01,40.9 XU2.1
LITE  (via drill 0.35)
  Top 0.152: v18.44,26.49 18.63,26.3 41.75,26.3 44.75,29.3 44.75,41.42 44.41,41.77 v43.67,41.77
  Bottom 0.152: U4.A1 v18.44,26.49 | Q1.1 v43.67,41.77 43.69,41.77 RN1.4
MMC0.CLK  (via drill 0.35)
  Signal 0.152: v19.7,10 19.05,9.35 19.05,8.25 18.25,7.45 17.8,7.45 15.35,9.9 12.77,9.9 2.4,20.27 2.4,30.32 6.15,34.06 6.15,45.6 v8.5,47.95
  Bottom 0.152: U4.B15 19.7,9.97 v19.7,10 | R24.1 v8.5,47.95 XU3.5
MMC0.CMD  (via drill 0.35)
  Signal 0.152: v19.7,8.7 19.7,7.55 19.2,7.05 12.75,7.05 1.85,17.95 1.85,30.25 5.2,33.6 5.2,46.85 v8.5,50.15
  Bottom 0.152: U4.B16 v19.7,8.7 | XU3.3 v8.5,50.15 R25.1
MMC0.D0  (via drill 0.35)
  Signal 0.152: v8.5,45.75 9.05,45.2 9.05,16.1 13.3,11.85 15.92,11.85 16.8,10.97 16.8,10.35 v18.45,8.7
  Bottom 0.152: U4.A16 17.82,8.07 v18.45,8.7 | R23.1 17.11,45.75 v8.5,45.75 XU3.7
MMC0.D1  (via drill 0.35)
  Signal 0.152: v18.45,10 16.4,12.05 16.4,13.7 9.7,20.4 9.7,36.75 9.4,37.06 9.4,39.3 9.65,39.55 v9.65,44.65
  Bottom 0.152: U4.A15 v18.45,9.99 v18.45,10 | XU3.8 v9.65,44.65 R22.1
MMC0.D2  (via drill 0.35)
  Signal 0.152: v10.31,52.35 10.31,39.55 10.57,39.29 10.57,37.02 10.3,36.75 10.3,20.25 17.85,12.7 17.85,11.9 17.95,11.8 18.95,11.8 20.34,10.41 20.34,9.31 v20.95,8.7
  Bottom 0.152: U4.C16 20.95,8.68 v20.95,8.7 | XU3.1 v10.31,52.35 R27.1
MMC0.D3  (via drill 0.35)
  Signal 0.152: v20.95,10 20.95,10.65 19.6,12 19.52,12 19.15,12.37 19.15,12.9 11,21.05 v11,51.25
  Bottom 0.152: U4.C15 20.95,9.95 v20.95,10 | XU3.2 v11,51.25 R26.1
NC  (1 unrouted)
ON_T
  Bottom 0.2: U1.2 47.95,55.15 48.45,55.65 C1.1
PB
  Bottom 0.152: S1.1' S1.1 52.27,52.38 52.27,53.92 51.55,54.65 49.5,54.65
  Bottom 0.2: U1.3 49.5,54.65
PD_T
  Bottom 0.2: U1.6 43.7,54.65 43.05,54 43.05,51.9 43.25,51.7 C2.1
PMIC1  (via drill 0.35)
  VCC 0.152: v3.68,22.99 2.82,22.12 2.82,17.98 6.66,14.15 23.04,14.15 24.38,12.8 25.78,12.8 27.13,14.15 31.5,14.15 v32.38,15.04
  Bottom 0.152: U4.N10 33.05,15.04 | 33.05,15.04 U4.N11 | TP8.TP 3.68,22.73 v3.68,22.99 | v32.38,15.04 33.05,15.04
PMIC2  (via drill 0.35)
  VCC 0.152: v32.41,22.68 31.11,21.39 31.11,18.67 28.32,15.87 27.05,15.87 25.88,14.71 7.8,14.71 3.68,18.82 v3.68,20.45
  Bottom 0.15: U4.N5 33.05,22.68 U4.N4
  Bottom 0.152: TP9.TP 3.68,20.19 v3.68,20.45 | v32.41,22.68 33.05,22.68
PMIC3  (via drill 0.35)
  VCC 0.152: v31.14,23.93 31.14,22.3 30.66,21.82 30.66,19.43 30.71,19.38 27.76,16.43 26.72,16.43 25.48,15.19 8,15.19 4.62,18.57 4.62,21.39 v6.22,22.99
  Bottom 0.15: U4.M4 31.14,23.32 U4.L4
  Bottom 0.152: TP10.TP 6.22,22.73 v6.22,22.99 | v31.14,23.93 31.14,23.32
PMIC4  (via drill 0.35)
  VCC 0.152: v23.52,22.66 24.18,22 26.44,22 27.48,20.95 27.48,19.33 23.72,15.57 11.1,15.57 v6.22,20.45
  Bottom 0.15: U4.E4 U4.D4
  Bottom 0.152: U4.E4 22.89,23.29 v23.52,22.66 | TP11.TP 6.22,20.19 v6.22,20.45
PMIC_PGOOD  (via drill 0.35)
  Top 0.152: v3.68,17.91 4.8,19.02 6.66,19.02 13.86,11.82 30.54,11.82 v33.73,15.01
  Bottom 0.15: U4.N12 U4.P11 | U4.P11 | 34.78,13.95 U4.P11
  Bottom 0.152: U5.2 38.83,14.46 38.57,14.72 38.25,14.72 37.32,13.79 34.94,13.79 34.78,13.95 | TP13.TP 3.68,17.65 v3.68,17.91 | U4.P11 v33.73,15.01
PROG
  Bottom 0.152: R10.2 U2.18
RFID_IRQ  (via drill 0.35)
  Top 0.152: v18.45,23.95 15.35,27.05 11.9,27.05 10.65,28.3 10.65,33 12.65,35 34.3,35 40.25,40.95 40.25,43 39.45,43.8 37.4,43.8 v36.65,43.05
  Bottom 0.152: v18.45,23.95 U4.B4 | U8.8 37.25,43.65 v36.65,43.05
RFID_MISC_1
  Bottom 0.152: R30.1 C26.2
RFID_MISC_2
  Bottom 0.152: R31.1 C27.2
RFID_OSC_IN
  Bottom 0.152: Y2.1 45.15,47.2 C22.1 44.9,47.8 44.65,48.05 43.25,48.05 42.2,47 U8.36
RFID_OSC_OUT
  Bottom 0.152: C21.1 Y2.3 43.52,45.17 42.2,46.5 U8.37
RFID_RXN
  Bottom 0.152: C27.1 29.8,42.95 31.35,42.95 32.2,43.8 32.2,46.3 32.9,47 U8.15
RFID_RXP  (via drill 0.35)
  Top 0.152: v31.95,48.1 29.45,48.1 26.45,51.1 v26.45,54.5
  Bottom 0.152: U8.16 32.55,47.5 v31.95,48.1 | v26.45,54.5 C26.1
RFID_TX1
  Bottom 0.152: L3.1 30.85,50.55 31.1,50.3 U8.21
RFID_TX2
  Bottom 0.152: L4.1 30.85,48.3 31.3,48.75 33.95,48.75 34.2,48.5 U8.18
RFID_VEN  (via drill 0.35)
  Top 0.152: v35.45,43.05 36.85,44.45 43.8,44.45 46.5,41.75 46.5,26.15 v43.45,23.1
  Bottom 0.152: U8.10 36.25,43.85 v35.45,43.05 TP26.TP | v43.45,23.1 41.12,20.77 U4.T6
RTC_1P8  (via drill 0.35)
  Top 0.152: v49.53,21.59 40.44,12.5 v37.63,12.5
  Signal 0.15: v37.63,12.5 32.38,12.5 v29.88,15
  Bottom 0.15: C10.1 U5.6 37.98,13.1 37.63,12.75 v37.63,12.5 | U4.K11 29.81,15 v29.88,15 30.45,14.43 U4.L11
  Bottom 0.152: TP18.TP v49.53,21.59
SIP_OSC_IN
  Bottom 0.15: C11.1 37.57,4.46 37.32,4.21 Y1.1
  Bottom 0.152: C11.1 37.95,4.76 38.21,5.02 38.21,5.83 36.79,7.25 35.14,7.25 U4.P16
SIP_OSC_OUT
  Bottom 0.15: C12.1 33.07,5.51 33.22,5.66 33.37,5.81 Y1.3
  Bottom 0.152: 33.22,5.66 33.05,5.83 U4.N16
SW1
  pour Bottom (rank 2): 46.45,5.75 45.6,5.75 45.6,7 44.2,7 44.2,8.75 46.45,8.75
SWAB2
  Bottom 0.15: U2.9 47.65,7.5 48.05,7.9 48.05,9.5 48.42,9.88 L2.1
  pour Bottom: 49.85,9.05 48.05,9.05 48.05,9.95 49.85,9.95
SWCD2
  Bottom 0.15: U2.10 48.05,7.15 48.33,7.42 L2.2
  pour Bottom: 49.85,6.65 49.85,7.5 48.05,7.5 48.05,6.65
SYS_VDD2_3P3V  (via drill 0.35)
  Signal 0.152: v24.82,13.79 22.61,11.58 22.61,10.54 23.01,10.13 35.94,10.13 36.85,9.22 36.85,7.92 39.85,4.93 46.69,4.93 53.37,11.61 53.37,27.91 v52.07,29.21
  Bottom 0.152: TP17.TP v52.07,29.21 | U4.F11 24.79,13.79 v24.82,13.79
  Bottom 0.2: U4.F11 U4.G11
SYS_VDD3_3P3V  (via drill 0.35)
  Signal 0.152: v52.07,26.67 50.95,27.79 48.23,27.79 46.81,26.36 34.42,26.36 31.11,23.06 31.11,20.22 28.5,17.6 v27.33,17.6
  Bottom 0.152: TP19.TP v52.07,26.67
  Bottom 0.2: U4.J7 U4.J8 | U4.H7 U4.H8
  pour Bottom: 30.88,18.65 30.88,16.55 23.83,16.55 23.83,18.65
SYS_VDD_1P8V  (via drill 0.35)
  Signal 0.152: v27.33,15.06 31.67,19.41 31.67,23.01 34.37,25.7 47.95,25.7 v49.53,24.13
  Bottom 0.152: TP20.TP v49.53,24.13
  pour Bottom: 31.03,15.95 23.78,15.95 23.78,15.4 26.38,15.4 26.38,14.25 28.28,14.25 28.28,15.4 31.03,15.4
SYS_VOUT  (via drill 0.35)
  Signal 0.152: v49.53,31.75 45.85,28.07 32.69,28.07 30.45,25.83 30.45,20.7 v29.87,20.12
  Bottom 0.152: TP15.TP v49.53,31.75
  pour Bottom: 30.83,20.9 30.83,19.25 29.03,19.25 29.03,20.9
TP_IRQ
  Bottom 0.152: XU1.1 10.5,18.55 10.95,18.1 12.15,18.1 13.55,19.5 | 13.55,19.5 16.05,22 16.05,27.33 16.69,27.97 20.43,27.97 20.98,27.43 20.98,26.72 21.2,26.5 23.52,26.5 U4.F2 | R18.1 12.75,20.3 13.55,19.5
TPM_SCL
  Bottom 0.15: R29.2
  Bottom 0.152: U6.29 6.62,34.27 6.87,34.52 R29.2 | R29.2 9.29,34.52 10.5,33.3 10.5,24.2 7.6,21.3 7.6,18.2 10.21,15.6 15.91,15.6 16.01,15.7 U4.A10
TPM_SDA
  Bottom 0.15: R28.2
  Bottom 0.152: U6.30 6.63,33.87 6.88,33.62 R28.2 | R28.2 8.83,33.62 10.1,32.35 10.1,24.23 7.29,21.43 7.29,18.08 10.3,15.07 18.45,15.07 U4.B10
UART0_RX  (via drill 1.02)
  Bottom 0.152: U4.A12 13.29,13.15 11.55,11.41 11.55,8.85 10.2,7.5 10.2,6.25 9.35,5.4 v4.65,5.4 TP21.RX
UART0_TX  (via drill 1.02)
  Bottom 0.152: TP21.TX v4.65,8.9 9.7,8.9 11.18,10.38 11.18,12.12 12.85,13.79 18.09,13.79 18.73,13.15 U4.B12
UART.RX_SIP.TX
  Bottom 0.152: U3.2 19.3,5.05 20.48,6.22 26.38,6.22 27.32,7.17 27.32,9.66 27.65,9.99 33.36,9.99 33.66,9.69 33.66,8.81 33.78,8.69 34.97,8.69 U4.R16
UART.TX_SIP.RX
  Bottom 0.152: U3.30 15.25,6.6 15.69,7.04 25.44,7.04 26.06,7.66 26.06,11.12 26.18,11.25 34.69,11.25 34.96,10.97 34.96,9.99 U4.P15
UART_3V3  (via drill 0.35)
  Top 0.152: v17.35,6.3 13.95,6.3 11.25,3.6 v11.25,1.2
  Bottom 0.15: U3.1 17.35,5.55 C9.1
  Bottom 0.152: v17.35,6.3 17.35,5.55 | U3.16 11.55,1.5 v11.25,1.2
USB+
  Bottom 0.152: U3.14 13.75,1.05 13.9,0.9 17.85,0.9 19.25,2.3 20.7,2.3 21.23,2.83 21.23,3.67 22.82,5.27 27.14,5.27 27.33,5.08 J1.3
USB-  (via drill 0.35)
  Top 0.152: v20.05,1.35 v20.05,3.3
  Bottom 0.152: U3.15 13.25,0.8 13.55,0.5 19.2,0.5 v20.05,1.35 | J1.2 27.98,5.18 27.39,5.77 22.52,5.77 v20.05,3.3
V_BAT_REF  (via drill 0.35)
  Top 0.152: v43.95,12.5 38.5,7.05 34.65,7.05 33.6,8.1 33.6,10.45 37.6,14.45 37.6,22.6 35.65,24.55 22.88,24.55 v20.98,22.65
  Bottom 0.15: U4.C6 20.98,21.41 v20.98,22.65
  Bottom 0.152: R15.1 R16.2 44.7,11.75 v43.95,12.5
VC2
  Bottom 0.15: U2.14 49.5,4.3 C5.2
VCC  (via drill 0.35, 1.02)
  Bottom 0.15: C8.1 U3.18 U3.19
  Bottom 0.152: C8.1 | v10.2,3.55 10.2,2.4 9.7,1.9 v4.65,1.9 TP21.VCC | U4.T9 39.83,16.96 TP7.TP
  other vias: 51.05,6 49.3,6 36.23,17.55 34.93,17.55 34.93,16.3 36.23,16.3 10.2,5
  pour Bottom: 36.93,17.55 36.93,16.3 34.28,16.3 34.28,17.55
  pour Bottom: 52.8,5.05 52.75,6.25 48.5,6.3 48.55,5.1
  pour VCC: 37.15,18.4 37.15,6 51.8,6 51.8,1.8 1.6,1.8 1.6,6 33.95,6 33.95,18.4
  pour Bottom: 0.45,6.15 13.3,6.15 13.35,2.55 0.45,2.55
VDD
  Bottom 0.152: U8.28 39.75,51.05 39.95,51.25 C25.1 | C25.1 40.55,51.25 40.75,51.05 U8.30 | U8.29 C25.1
VDD(MID)
  Bottom 0.152: C35.1 U8.17
VDD(TX)  (via drill 0.35)
  Top 0.152: v36.75,51.45 36.75,50 v32.9,46.15
  Bottom 0.152: U8.22 v36.75,51.45 C34.1 | U8.14 33.25,46.5 v32.9,46.15
VDD_CORE  (via drill 0.35)
  Signal 0.152: v46.99,24.13 46.08,25.04 36.12,25.04 33.2,22.12 33.2,19.33 32.87,19 32.16,19 27.64,14.48 27.13,14.48 26.62,14.99 26.62,18.59 27.37,19.34 27.37,21.37 v24.79,23.95
  Bottom 0.152: TP23.TP v46.99,24.13 | v24.79,23.95 U4.G4
VDD_MPU  (via drill 0.35)
  Signal 0.152: v49.53,26.67 52.12,24.08 52.12,12.01 46.25,6.15 40.72,6.15 40.26,6.6 40.26,9.78 38.13,11.91 24.18,11.91 v23.52,11.25
  Bottom 0.152: TP24.TP v49.53,26.67 | U4.F13 v23.52,11.25
VDDS_DDR  (via drill 0.35)
  Top 0.152: v20.98,23.93 22.25,25.2 36.22,25.2 39.83,21.59 v46.99,21.59
  Bottom 0.152: v46.99,21.59 TP22.TP | v20.98,23.93 23.54,23.93 U4.F4
VDDS_PLL  (via drill 0.35)
  Signal 0.152: v24.79,11.25 36.12,11.25 39.14,8.23 39.14,6.53 39.88,5.79 46.48,5.79 52.76,12.06 52.76,27.2 50.75,29.21 v49.53,29.21
  Bottom 0.152: TP25.TP v49.53,29.21 | U4.G13 v24.79,11.25
VIN_AC
  Bottom 0.15: U4.P10 U4.R10 U4.T10
VIN_BAT
  Bottom 0.15: U4.T8 U4.R8 U4.P8 U4.N7
VIN_USB  (via drill 0.35)
  Top 0.152: v44.94,3.3 45.79,2.45 v49.8,2.45
  Top 0.2: v44.94,3.3 37.31,3.3 v36.42,2.41
  Bottom 0.152: R5.2 49.7,2.55 v49.8,2.45 50.19,2.06 TP2.TP | C3.1 46.23,2.37 46.45,2.58 U2.20
  Bottom 0.2: J1.1 28.63,5.03 29.4,5.8 31.65,5.8 32.25,5.2 32.25,3.6 33.81,2.04 36.05,2.04 v36.42,2.41 | R8.2 44.29,2.65 v44.94,3.3 U2.20

### Text on the board
tPlace: Cypher v1.0 / © 2018 Megahash Corp | GND | TX | RX | VCC | www.megahash.us